# EasyEDA Pro project 同轴电缆.eprj, board 信号调理
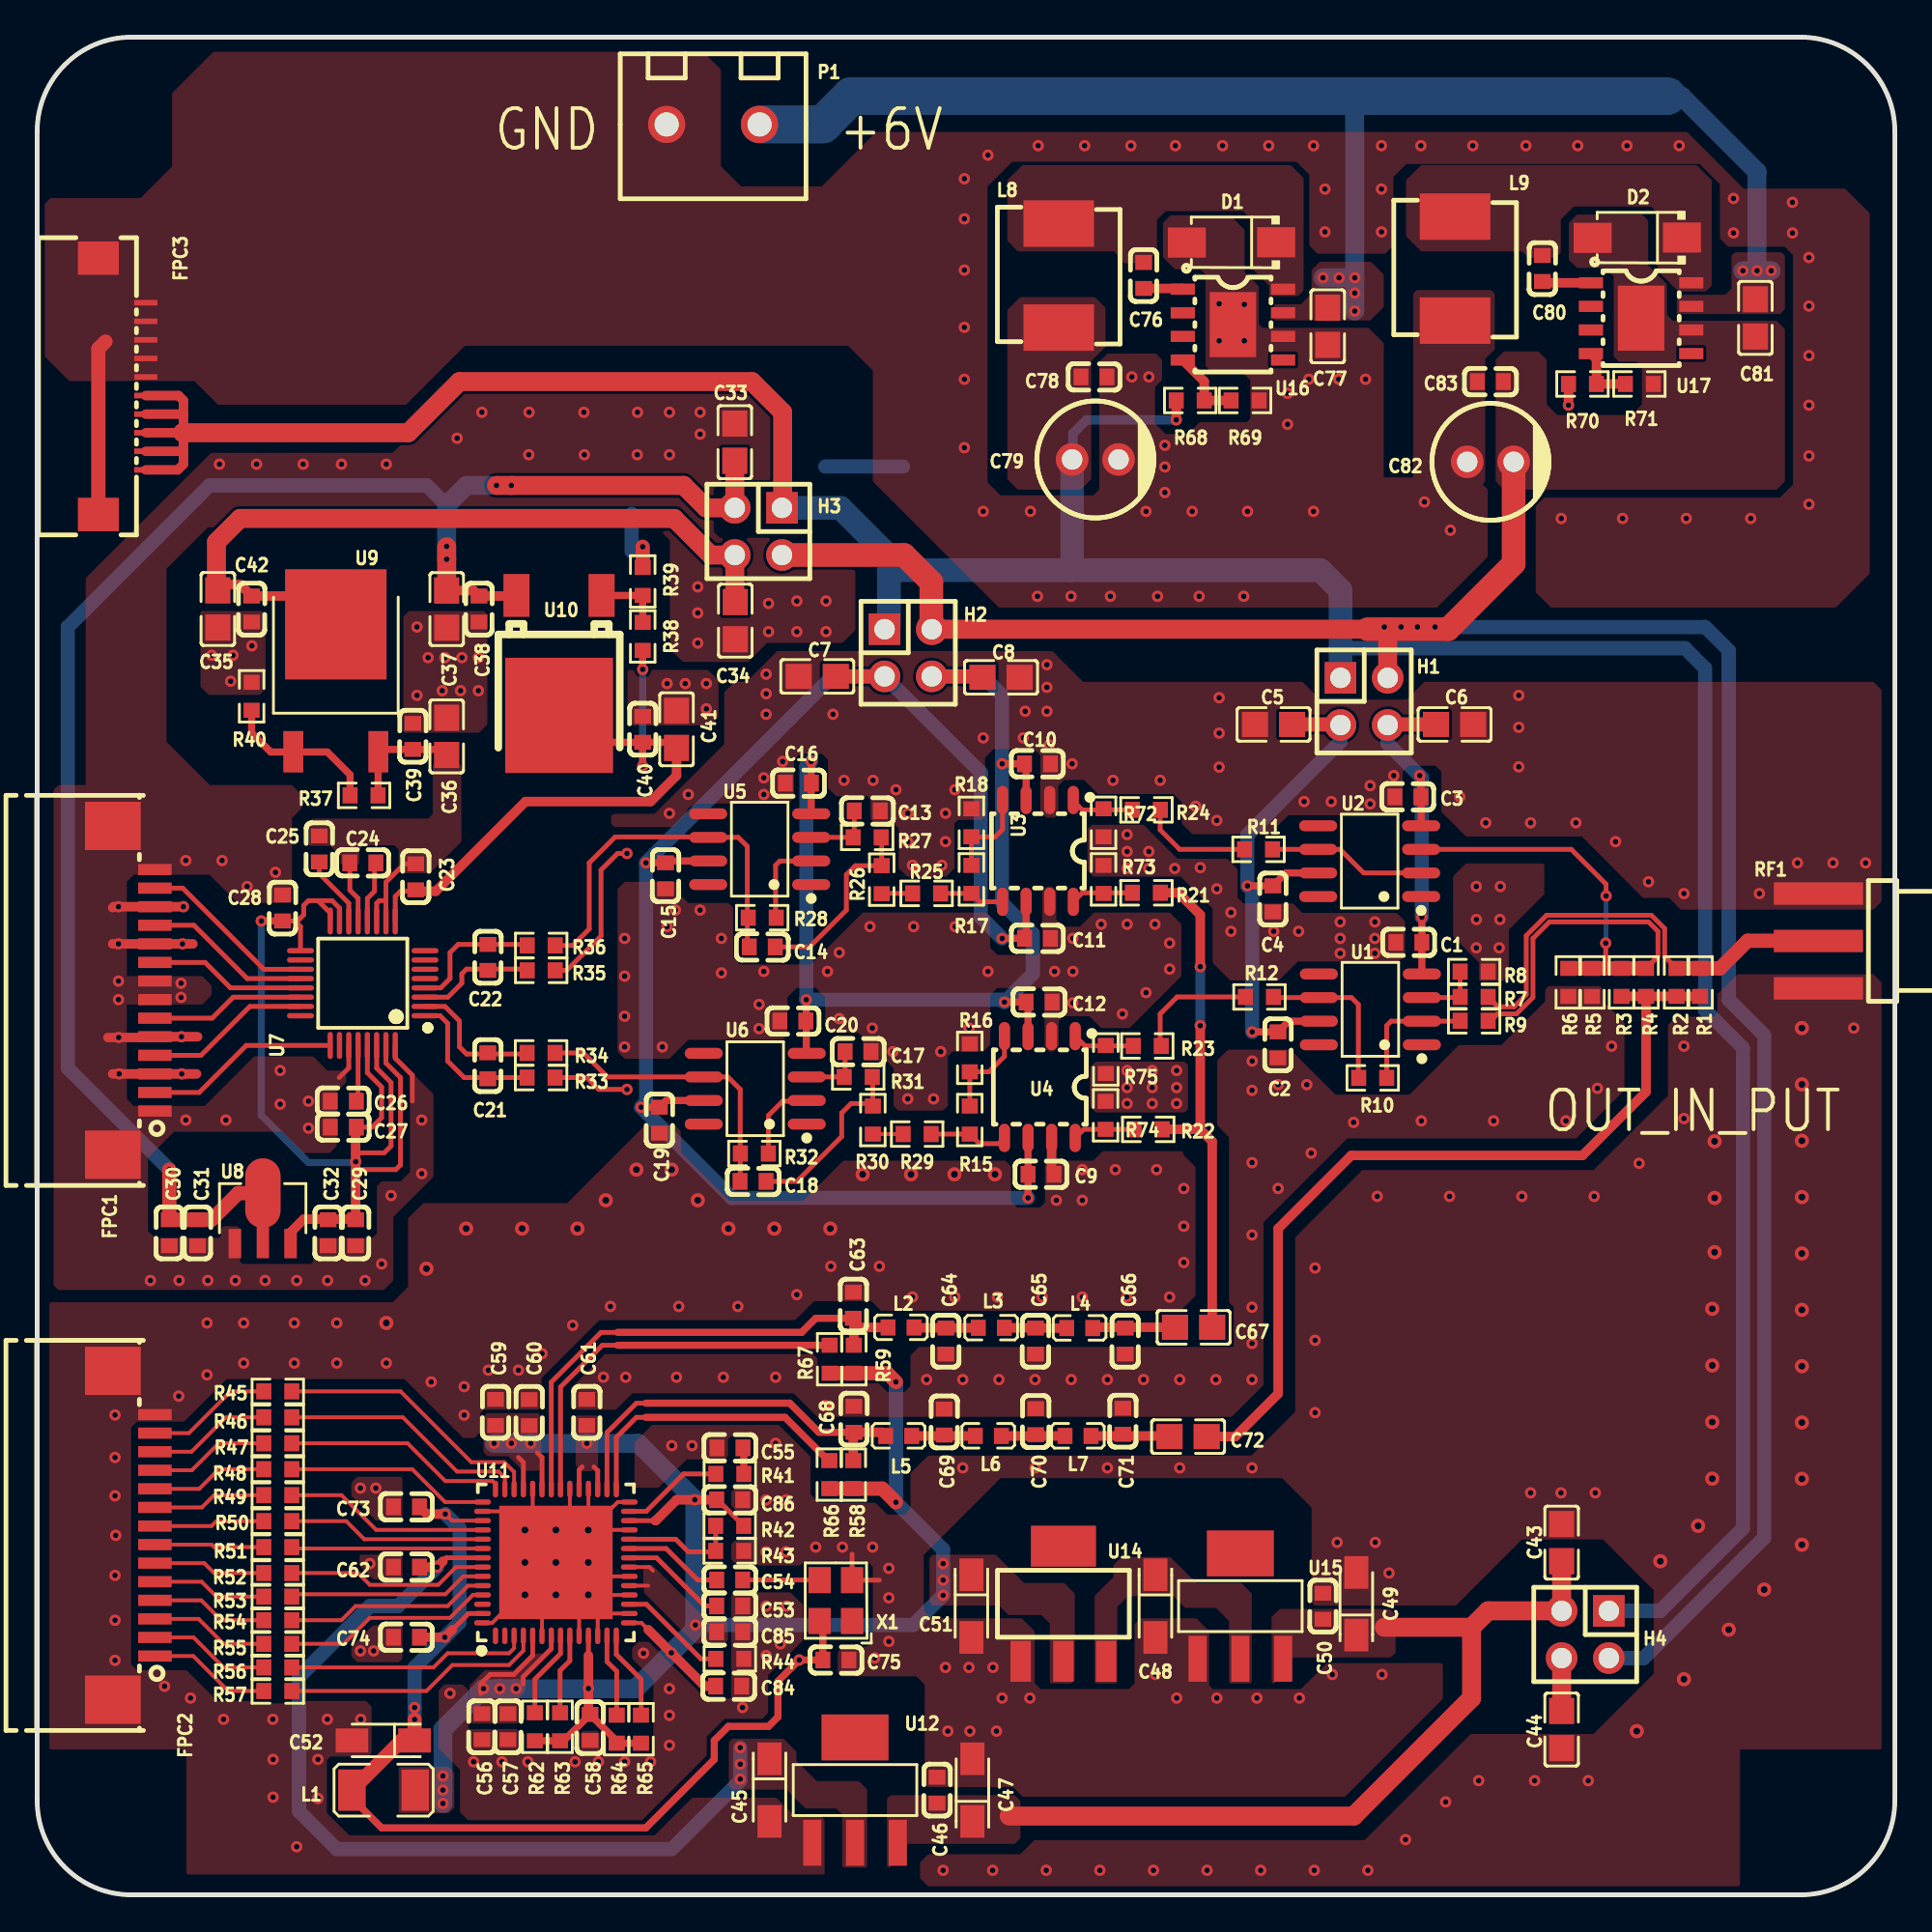
[diagram p5: board, top side]
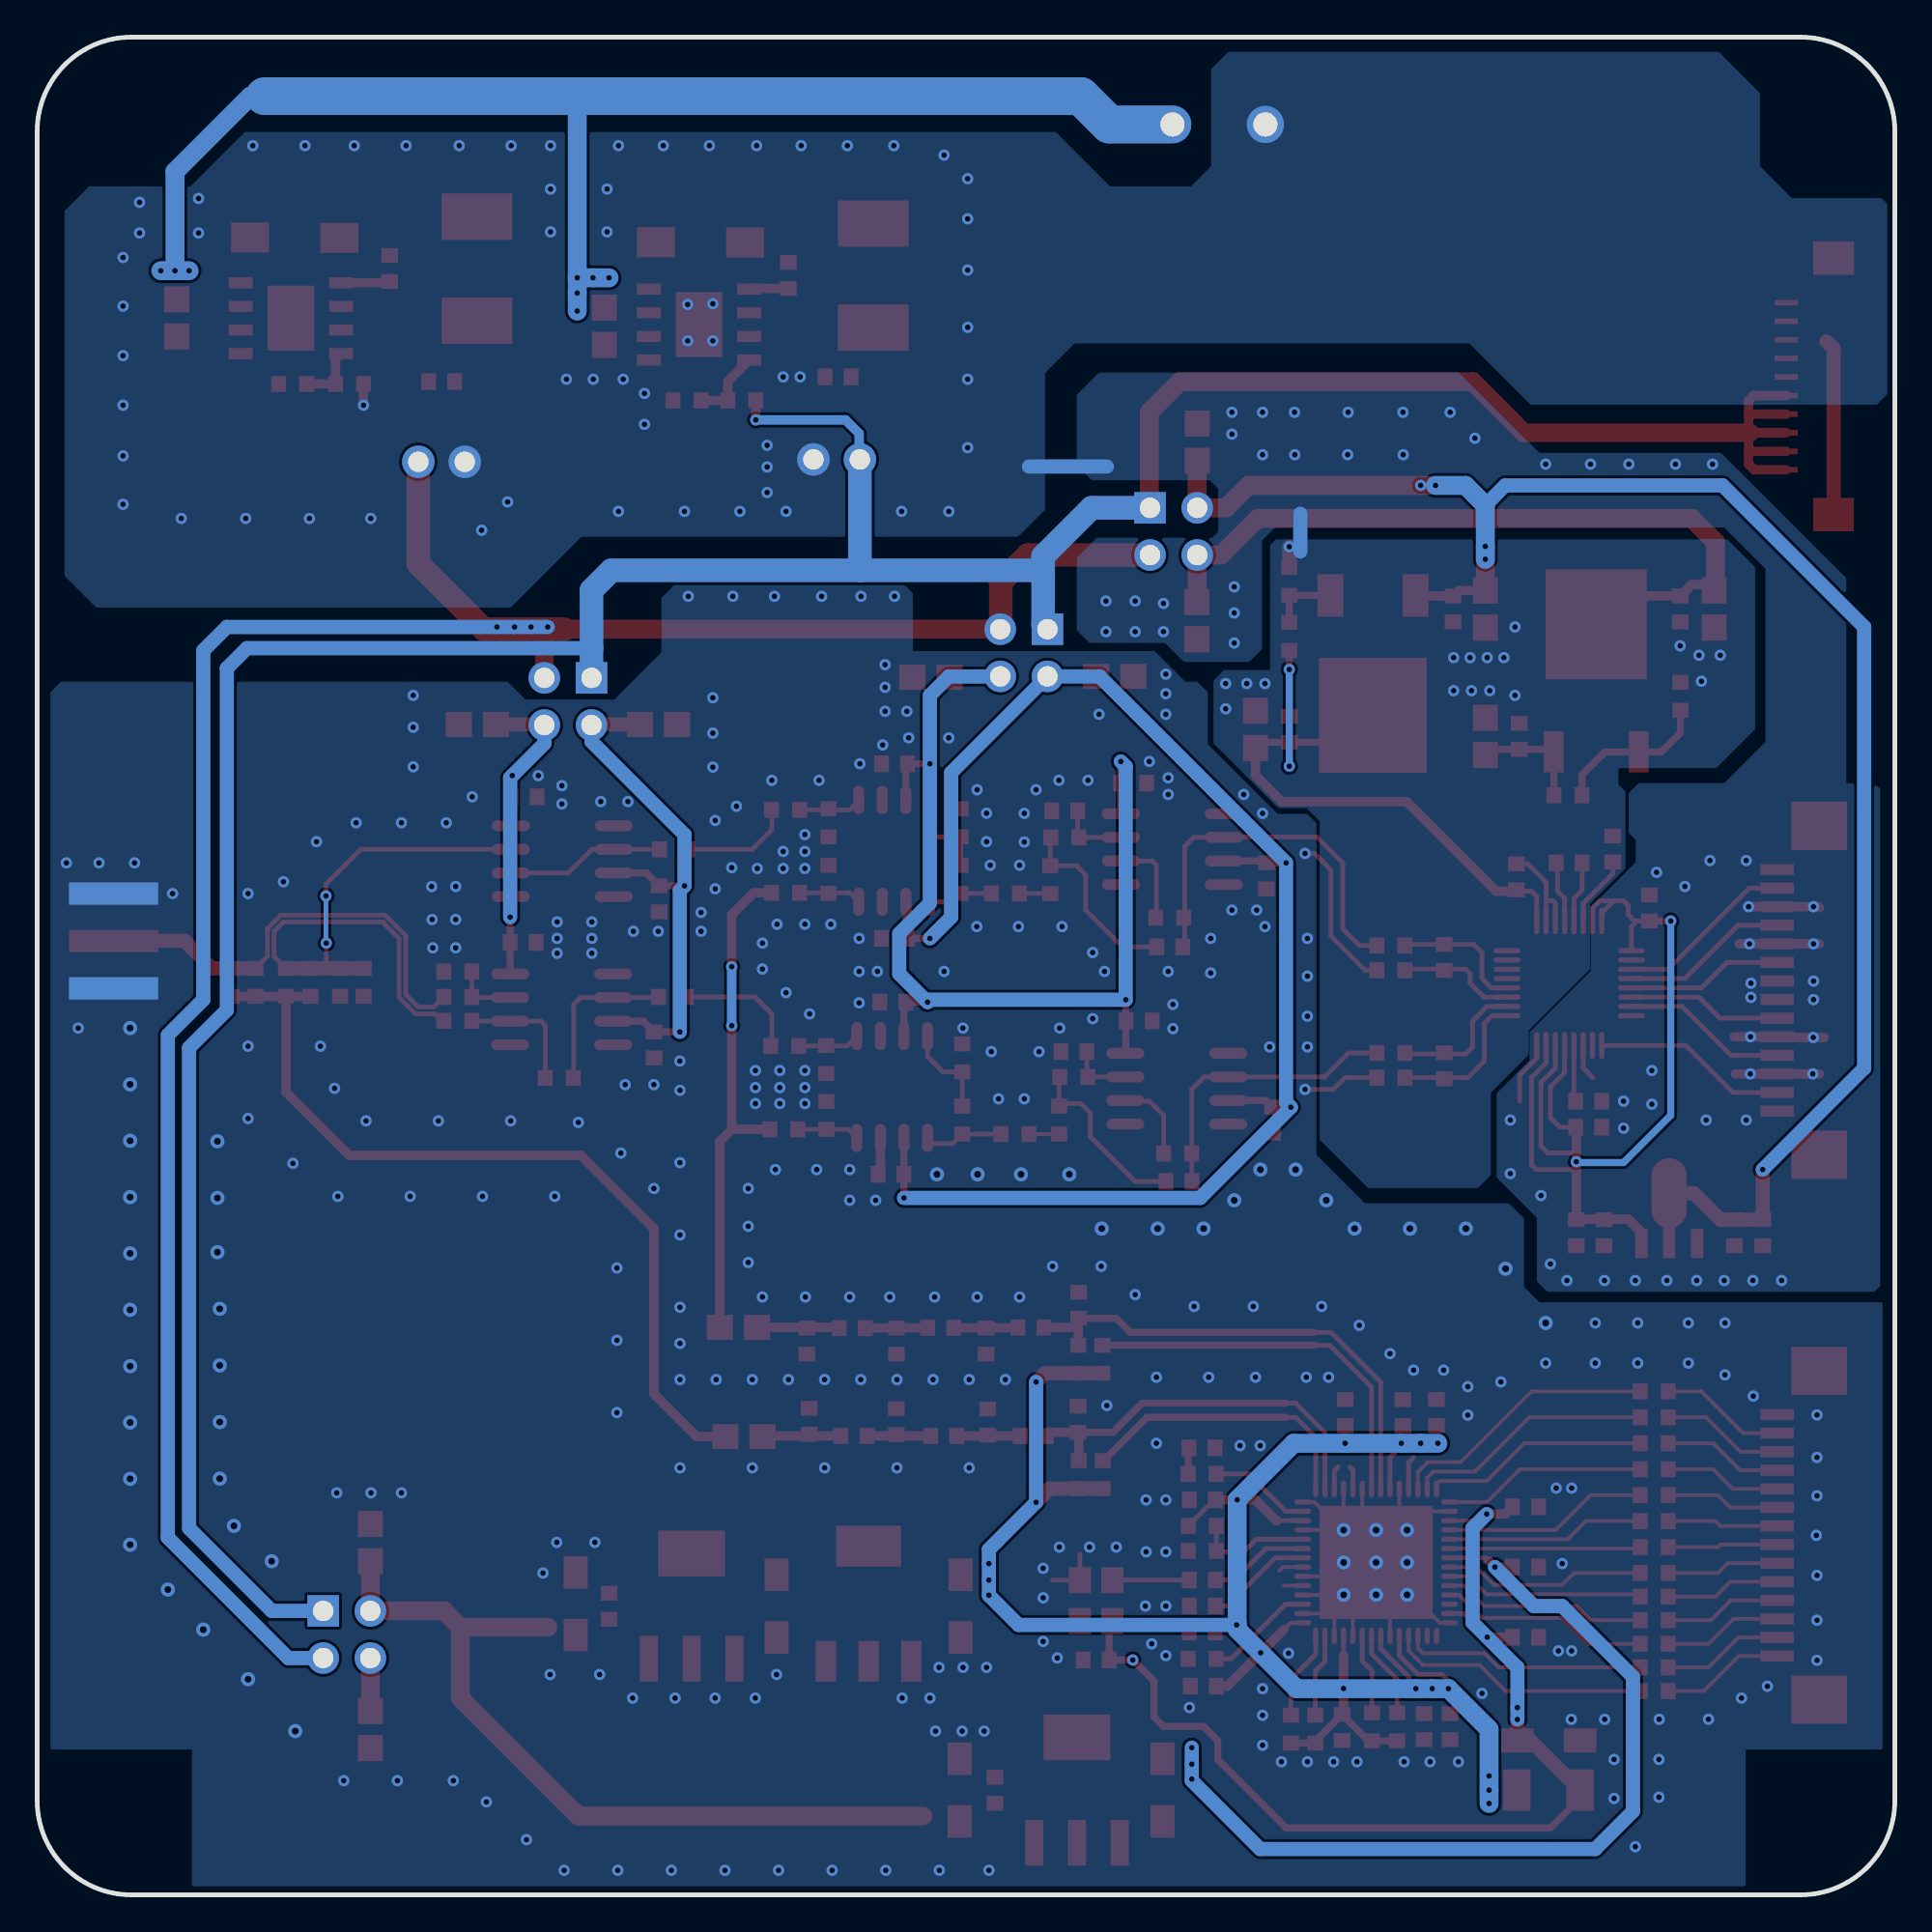
[diagram p6: board, bottom side, seen from below]

Outline 100 x 100 mm; copper layers: Top Layer, Bottom Layer. Coordinates in mm from the lower left corner of the outline.
Outline path: 0,94.92 0,5.08 arc(1.49,1.49) 5.08,0 94.92,0 arc(98.51,1.49) 100,5.08 100,94.92 arc(98.51,98.51) 94.92,100 5.08,100 arc(1.49,98.51) 0,94.92
Stack: Top Layer 0.035mm / Dielectric1 1.51mm FR4 er 4.5 / Bottom Layer 0.035mm

## Design rules (mm)
template: 自定义配置
spacing copperThickness1oz (default): track to track 0.102, other pairs 0.152 to 0.3
spacing copperThickness2oz: track to track 0.203, other pairs 0.152 to 0.3
track width copperThickness1oz (default): min 0.127, default 0.254, max 2.54
track width copperThickness2oz: min 0.203, default 0.254, max 2.54
differential pair differentialPair (default): width min 0.127, default 0.254, max 2.54; gap min 0.152, default 0.152
via viaSize (default): diameter min 0.5, default 0.61, max 10; hole min 0.3, default 0.305, max 6.3

## Placement (name value [footprint] x y rotation side)
C1  100nF  [C0603]  73.84 51.27 0 top
C2  100nF  [C0603]  66.79 45.75 270 top
C3  100nF  [C0603]  73.79 59.11 0 top
C4  100nF  [C0603]  66.52 53.61 90 top
C5  10uF  [C0805]  66.56 63 0 top
C6  10uF  [C0805]  76.3 63 180 top
C7  10uF  [C0805]  41.99 65.59 0 top
C8  10uF  [C0805]  51.89 65.54 180 top
C9  100nF  [C0603]  54.04 38.79 0 top
C10  100nF  [C0603]  53.85 60.88 0 top
C11  100nF  [C0603]  53.85 51.49 0 top
C12  100nF  [C0603]  53.94 48.06 0 top
C13  1nF  [C0603]  44.69 58.35 180 top
C14  2.2nF  [C0603]  39.03 51.03 180 top
C15  100nF  [C0603]  33.82 54.85 270 top
C16  100nF  [C0603]  40.97 59.84 180 top
C17  1nF  [C0603]  44.19 45.39 180 top
C18  2.2nF  [C0603]  38.54 38.41 180 top
C19  100nF  [C0603]  33.5 41.7 270 top
C20  100nF  [C0603]  40.68 47.04 180 top
C21  1nF  [C0603]  24.26 44.63 270 top
C22  1nF  [C0603]  24.26 50.46 270 top
C23  1uF  [C0603]  20.38 54.8 270 top
C24  1uF  [C0603]  17.53 55.55 0 top
C25  1uF  [C0603]  15.19 56.3 270 top
C26  1uF  [C0603]  16.48 42.72 0 top
C27  1uF  [C0603]  16.48 41.33 0 top
C28  1uF  [C0603]  13.21 53.12 90 top
C29  1uF  [C0603]  17.14 35.64 90 top
C30  1uF  [C0603]  7.11 35.64 90 top
C31  100nF  [C0603]  8.64 35.64 90 top
C32  100nF  [C0603]  15.66 35.64 90 top
C33  10uF  [C0805]  37.55 78.2 270 top
C34  10uF  [C0805]  37.58 68.59 90 top
C35  10uF  [C0805]  9.73 69.22 90 top
C36  10uF  [C0805]  22.04 62.36 270 top
C37  10uF  [C0805]  22.04 69.21 90 top
C38  100nF  [C0603]  23.78 69.22 90 top
C39  100nF  [C0603]  20.22 62.36 270 top
C40  100nF  [C0603]  32.59 62.74 270 top
C41  10uF  [C0805]  34.42 62.74 270 top
C42  100nF  [C0603]  11.55 69.22 90 top
C43  10uF  [C0805]  82.06 18.96 270 top
C44  10uF  [C0805]  82.06 8.9 90 top
C45  10uF  [CAP-SMD_L3.2-W1.6-RD-C7171]  39.42 5.64 270 top
C46  10uF  [CAP-SMD_L3.2-W1.6-RD-C7171]  50.34 5.64 90 top
C47  100nF  [C0603]  48.44 5.63 270 top
C48  10uF  [CAP-SMD_L3.2-W1.6-RD-C7171]  60.2 15.54 270 top
C49  10uF  [CAP-SMD_L3.2-W1.6-RD-C7171]  71.01 15.67 90 top
C50  100nF  [C0603]  69.21 15.54 270 top
C51  10uF  [CAP-SMD_L3.2-W1.6-RD-C7171]  50.29 15.54 270 top
C52  10uF  [CAP-SMD_L3.2-W1.6-RD-C7171]  18.63 8.31 180 top
C53  10nF  [C0603]  37.28 15.55 180 top
C54  10nF  [C0603]  37.28 16.95 180 top
C55  680pF  [C0603]  37.3 24.06 0 top
C56  100nF  [C0603]  23.94 9.05 90 top
C57  100nF  [C0603]  25.34 9.05 90 top
C58  100nF  [C0603]  29.76 9.01 90 top
C59  100nF  [C0603]  24.67 25.97 270 top
C60  100nF  [C0603]  26.48 25.96 270 top
C61  100nF  [C0603]  29.59 25.97 270 top
C62  100nF  [C0603]  19.88 17.64 0 top
C63  4.7pF  [C0603]  43.94 31.74 270 top
C64  24pF  [C0603]  48.92 29.81 90 top
C65  33pF  [C0603]  53.74 29.81 90 top
C66  18pF  [C0603]  58.57 29.81 90 top
C67  10uF  [C0805]  62.25 30.55 180 top
C68  4.7pF  [C0603]  43.96 25.6 270 top
C69  24pF  [C0603]  48.83 25.45 270 top
C70  33pF  [C0603]  53.75 25.47 270 top
C71  18pF  [C0603]  58.44 25.49 270 top
C72  10uF  [C0805]  61.95 24.67 180 top
C73  100nF  [C0603]  19.88 20.89 0 top
C74  100nF  [C0603]  19.88 13.87 0 top
C75  10nF  [C0603]  43 12.64 180 top
C76  10nF  [C0603]  59.56 87.17 90 top
C77  10uF  [C0805]  69.47 84.44 90 top
C78  100nF  [C0603]  56.89 81.71 180 top
C79  220uF  [CAP-TH_BD6.3-P2.50-D0.6-FD-1]  56.96 77.27 0 top
C80  10nF  [C0603]  81.03 87.55 90 top
C81  10uF  [C0805]  92.49 84.89 90 top
C82  100nF  [C0603]  78.22 81.46 180 top
C83  220uF  [CAP-TH_BD6.3-P2.50-D0.6-FD-1]  78.23 77.14 0 top
C84  100nF  [C0603]  37.22 11.23 180 top
C85  100nF  [C0603]  37.28 14.16 180 top
C86  100nF  [C0603]  37.28 21.27 180 top
D1  SS54  [SMA_L4.3-W2.6-LS5.0-RD]  64.29 88.95 180 top
D2  SS54  [SMA_L4.3-W2.6-LS5.0-RD]  86.14 89.2 180 top
FPC1  AFA07-S14FCA-00  [FPC-SMD_P1.00-14P_LCS-XJ-H2.5]  5.21 48.69 90 top
FPC2  AFA07-S14FCA-00  [FPC-SMD_P1.00-14P_LCS-XJ-H2.5]  5.21 19.35 90 top
FPC3  AFA01-S10FCA-00  [FPC-SMD_10P-P1.0_FGS-XJ-H2.0]  4.57 81.2 90 top
H1  PZ254V-12-4P  [HDR-TH_4P-P2.54-V-M-R2-C2-S2.54]  71.43 64.24 270 top
H2  PZ254V-12-4P  [HDR-TH_4P-P2.54-V-M-R2-C2-S2.54]  46.89 66.86 270 top
H3  PZ254V-12-4P  [HDR-TH_4P-P2.54-V-M-R2-C2-S2.54]  38.82 73.39 180 top
H4  PZ254V-12-4P  [HDR-TH_4P-P2.54-V-M-R2-C2-S2.54]  83.33 14.02 180 top
L1  10uH  [L1210]  18.65 5.64 180 top
L2  47nH  [L0603]  46.5 30.54 0 top
L3  82nH  [L0603]  51.36 30.52 0 top
L4  68nH  [L0603]  56.12 30.51 0 top
L5  47nH  [L0603]  46.38 24.7 0 top
L6  82nH  [L0603]  51.2 24.7 0 top
L7  68nH  [L0603]  56.03 24.7 0 top
L8  22uH  [IND-SMD_L7.1-W6.6_SLO0618H]  54.99 87.17 270 top
L9  22uH  [IND-SMD_L7.1-W6.6_SLO0618H]  76.33 87.54 270 top
P1  WJ126V-5.0-2P  [CONN-TH_WJ126V-5.0-2P]  36.39 95.3 270 top
R1  100Ω  [R0603]  89.51 49.12 270 top
R2  100Ω  [R0603]  88.25 49.12 270 top
R3  100Ω  [R0603]  85.29 49.12 270 top
R4  100Ω  [R0603]  86.61 49.12 270 top
R5  100Ω  [R0603]  83.69 49.12 90 top
R6  100Ω  [R0603]  82.42 49.12 90 top
R7  10kΩ  [R0603]  77.35 48.33 0 top
R8  10kΩ  [R0603]  77.35 49.7 180 top
R9  10kΩ  [R0603]  77.35 47.05 180 top
R10  10kΩ  [R0603]  71.89 43.98 180 top
R11  49.9Ω  [R0603]  65.75 56.28 0 top
R12  49.9Ω  [R0603]  65.8 48.33 0 top
R15  2kΩ  [R0603]  50.2 41.71 270 top
R16  2kΩ  [R0603]  50.2 45.06 270 top
R17  2kΩ  [R0603]  50.29 54.66 270 top
R18  2kΩ  [R0603]  50.29 57.71 270 top
R21  49.9Ω  [R0603]  59.71 53.94 0 top
R22  49.9Ω  [R0603]  59.81 41.21 0 top
R23  0Ω  [R0603]  59.76 45.69 180 top
R24  0Ω  [R0603]  59.71 58.41 180 top
R25  0Ω  [R0603]  47.88 53.91 180 top
R26  2.7kΩ  [R0603]  45.46 54.65 90 top
R27  4.7kΩ  [R0603]  44.68 56.92 180 top
R28  0Ω  [R0603]  39.03 52.6 180 top
R29  0Ω  [R0603]  47.37 40.95 180 top
R30  2.7kΩ  [R0603]  44.99 41.71 90 top
R31  4.7kΩ  [R0603]  44.2 44.03 180 top
R32  0Ω  [R0603]  38.61 39.91 180 top
R33  10Ω  [R0603]  27.13 43.99 180 top
R34  10Ω  [R0603]  27.13 45.32 180 top
R35  10Ω  [R0603]  27.13 49.77 180 top
R36  10Ω  [R0603]  27.13 51.11 180 top
R37  1kΩ  [R0603]  17.6 59.18 0 top
R38  1kΩ  [R0603]  32.6 67.74 270 top
R39  1kΩ  [R0603]  32.6 70.7 270 top
R40  1kΩ  [R0603]  11.55 64.52 270 top
R41  1kΩ  [R0603]  37.29 22.66 180 top
R42  0Ω  [R0603]  37.28 19.86 0 top
R43  NC  [R0603]  37.28 18.52 180 top
R44  1.8kΩ  [R0603]  37.29 12.7 180 top
R45  100Ω  [R0603]  12.95 27.1 0 top
R46  100Ω  [R0603]  12.95 25.71 0 top
R47  100Ω  [R0603]  12.95 24.31 0 top
R48  100Ω  [R0603]  12.95 22.91 0 top
R49  100Ω  [R0603]  12.95 21.51 0 top
R50  100Ω  [R0603]  12.95 20.12 0 top
R51  100Ω  [R0603]  12.95 18.72 0 top
R52  100Ω  [R0603]  12.95 17.32 0 top
R53  100Ω  [R0603]  12.95 16.05 0 top
R54  100Ω  [R0603]  12.95 14.78 0 top
R55  100Ω  [R0603]  12.95 13.51 0 top
R56  100Ω  [R0603]  12.95 12.24 0 top
R57  100Ω  [R0603]  12.95 10.97 0 top
R58  49.9Ω  [R0603]  43.93 22.62 90 top
R59  49.9Ω  [R0603]  43.96 28.83 90 top
R62  100Ω  [R0603]  26.79 9.05 90 top
R63  100Ω  [R0603]  28.15 9.05 90 top
R64  100Ω  [R0603]  31.2 8.92 90 top
R65  100Ω  [R0603]  32.51 8.92 90 top
R66  100Ω  [R0603]  42.65 22.62 90 top
R67  100Ω  [R0603]  42.66 28.83 90 top
R68  10kΩ  [R0603]  62.07 80.44 180 top
R69  3.24kΩ  [R0603]  65.02 80.44 180 top
R70  10kΩ  [R0603]  83.19 81.33 180 top
R71  3.24kΩ  [R0603]  86.25 81.33 180 top
R72  2kΩ  [R0603]  57.4 57.71 270 top
R73  2kΩ  [R0603]  57.4 54.66 270 top
R74  2kΩ  [R0603]  57.51 41.96 270 top
R75  2kΩ  [R0603]  57.53 44.97 270 top
RF1  BWSMA-KE-P001  [SMA-SMD_BWSMA-KE-P001]  95.88 51.35 0 top
U1  THS4011IDG4  [SOIC-8_L4.9-W3.9-P1.27-LS6.0-BL]  71.77 47.66 90 top
U2  THS4011IDG4  [SOIC-8_L4.9-W3.9-P1.27-LS6.0-BL]  71.73 55.64 90 top
U3  AD835ARZ  [SOIC-8_L4.9-W3.9-P1.27-LS6.0-TL]  53.87 56.2 270 top
U4  AD835ARZ  [SOIC-8_L4.9-W3.9-P1.27-LS6.0-TL]  53.97 43.48 270 top
U5  OPA227UA  [SOIC-8_L4.9-W3.9-P1.27-LS6.0-BL]  38.9 56.29 90 top
U6  OPA227UA  [SOIC-8_L4.9-W3.9-P1.27-LS6.0-BL]  38.65 43.39 90 top
U7  ADS131A04IPBS  [TQFP-32_L5.0-W5.0-P0.50-LS7.0-BL]  17.53 49.07 90 top
U8  HT7533-1  [SOT-89_L4.5-W2.5-P1.50-LS4.2-BR]  12.14 36.42 270 top
U9  LM337KVURG3  [DPAK-3_L6.6-W6.1-P2.28-LS9.9-BR]  16.08 64.96 270 top
U10  LM317MKVURG3  [TO-252-3_L6.5-W6.1-P4.58-TL]  28.09 66.72 270 top
U11  AD9959BCPZ-REEL7  [LFCSP-56_L8.0-W8.0-P0.50-BL-EP]  27.92 17.89 0 top
U12  AMS1117-3.3  [SOT-223-4_L6.5-W3.5-P2.30-LS7.0-BR]  44.03 5.64 270 top
U14  AMS1117-1.8  [SOT-223_L6.7-W3.5-P2.30-BR]  55.24 15.67 270 top
U15  AMS1117-3.3  [SOT-223-4_L6.5-W3.5-P2.30-LS7.0-BR]  64.77 15.54 270 top
U16  TPS5430DDAR  [ESOP-8_L4.9-W3.9-P1.27-LS6.0-TL-EP]  64.37 84.53 0 top
U17  TPS5430DDAR  [ESOP-8_L4.9-W3.9-P1.27-LS6.0-TL-EP]  86.34 84.87 0 top
X1  25MHz  [OSC-SMD_4P-L3.2-W2.5-BL]  43 15.84 90 top

## Footprints (pads in the part's own frame, mm; a bottom-side part is the same pattern mirrored in y, then rotated)
C0603
  rect 0.8x0.9 smd: 1(-0.7,0) 2(0.7,0)
C0805
  rect 1.41x1.35 smd: 1(-1,0) 2(1,0)
CAP-SMD_L3.2-W1.6-RD-C7171
  rect 1.758x1.296 smd: 1(-1.687,0) 2(1.687,0)
CAP-TH_BD6.3-P2.50-D0.6-FD-1
  round 1.75 hole 1.1: 1(-1.25,0) 2(1.25,0)
CONN-TH_WJ126V-5.0-2P
  round 2 hole 1.3: 1(0,2.501) 2(0,-2.501)
DPAK-3_L6.6-W6.1-P2.28-LS9.9-BR
  rect 2.223x1.071 smd: 1(3.428,-2.29) 3(3.428,2.29)
  rect 5.925x5.46 smd: 2(-3.428,0)
ESOP-8_L4.9-W3.9-P1.27-LS6.0-TL-EP
  rect 1.3x0.6 smd: 1(-2.7,1.905) 2(-2.7,0.635) 3(-2.7,-0.635) 4(-2.7,-1.905) 5(2.7,-1.905) 6(2.7,-0.635) 7(2.7,0.635) 8(2.7,1.905)
  rect 2.5x3.5 smd: 9(0,0)
FPC-SMD_10P-P1.0_FGS-XJ-H2.0
  rect 0.3x1.25 smd: 1(-4.497,-1.276) 2(-3.498,-1.276) 3(-2.498,-1.276) 4(-1.497,-1.276) 5(-0.497,-1.276) 6(0.502,-1.276) 7(1.502,-1.276) 8(2.503,-1.276) 9(3.502,-1.274) 10(4.503,-1.274)
  rect 1.8x2.2 smd: 11(-6.9,1.276) 12(6.9,1.276)
FPC-SMD_P1.00-14P_LCS-XJ-H2.5
  rect 0.6x1.8 smd: 1(-6.5,-1.133) 2(-5.5,-1.131) 3(-4.5,-1.131) 4(-3.5,-1.131) 5(-2.5,-1.131) 6(-1.5,-1.131) 7(-0.5,-1.131) 8(0.499,-1.131) 9(1.5,-1.131) 10(2.499,-1.131) 11(3.499,-1.131) 12(4.5,-1.131) 13(5.5,-1.131) 14(6.5,-1.131)
  rect 2.6x3 smd: 15(-8.85,1.133) 16(8.85,1.133)
HDR-TH_4P-P2.54-V-M-R2-C2-S2.54
  rect 1.7x1.7 hole 1.1: 1(-1.27,-1.27)
  round 1.7 hole 1.1: 2(-1.27,1.27) 3(1.27,-1.27) 4(1.27,1.27)
IND-SMD_L7.1-W6.6_SLO0618H
  rect 2.5x3.8 smd: 1(-2.8,0) 2(2.8,0)
L0603
  rect 0.8x0.864 smd: 1(-0.7,0) 2(0.7,0)
L1210
  rect 1.474x2.22 smd: 1(-1.703,0) 2(1.703,0)
LFCSP-56_L8.0-W8.0-P0.50-BL-EP
  oval 0.28x0.9 smd: 1(-3.251,-3.95) 2(-2.751,-3.95) 3(-2.251,-3.95) 4(-1.75,-3.95) 5(-1.25,-3.95) 6(-0.749,-3.95) 7(-0.249,-3.95) 8(0.249,-3.95) 9(0.75,-3.95) 10(1.25,-3.95) 11(1.75,-3.95) 12(2.251,-3.95) 13(2.751,-3.95) 14(3.252,-3.95) 29(3.252,3.95) 30(2.751,3.95) 31(2.251,3.95) 32(1.75,3.95) 33(1.25,3.95) 34(0.75,3.95) 35(0.249,3.95) 36(-0.249,3.95) 37(-0.749,3.95) 38(-1.25,3.95) 39(-1.75,3.95) 40(-2.251,3.95) 41(-2.751,3.95) 42(-3.251,3.95)
  oval 0.9x0.28 smd: 15(3.95,-3.252) 16(3.95,-2.751) 17(3.95,-2.251) 18(3.95,-1.75) 19(3.95,-1.25) 20(3.95,-0.75) 21(3.95,-0.249) 22(3.95,0.249) 23(3.95,0.749) 24(3.95,1.25) 25(3.95,1.75) 26(3.95,2.251) 27(3.95,2.751) 28(3.95,3.251) 43(-3.95,3.251) 44(-3.95,2.751) 45(-3.95,2.251) 46(-3.95,1.75) 47(-3.95,1.25) 48(-3.95,0.749) 49(-3.95,0.249) 50(-3.95,-0.249) 51(-3.95,-0.75) 52(-3.95,-1.25) 53(-3.95,-1.75) 54(-3.95,-2.251) 55(-3.95,-2.751) 56(-3.95,-3.252)
  rect 6.1x6.1 smd: 57(0,0)
OSC-SMD_4P-L3.2-W2.5-BL
  rect 1.4x1.2 smd: 1(-1.1,-0.875) 2(1.1,-0.875) 3(1.1,0.875) 4(-1.1,0.875)
R0603
  rect 0.806x0.864 smd: 1(-0.753,0) 2(0.753,0)
SMA-SMD_BWSMA-KE-P001
  rect 4.8x1.2 smd: 1(0,-2.55) 2(0,2.55) 5(0,0)
  rect 4.8x1.2 smd far side: 3(0,2.55) 4(0,-2.55)
SMA_L4.3-W2.6-LS5.0-RD
  rect 2.046x1.62 smd: 1(-2.404,-0.009) 2(2.404,0.009)
SOIC-8_L4.9-W3.9-P1.27-LS6.0-BL
  oval 0.588x2.045 smd: 1(-1.905,-2.772) 2(-0.635,-2.772) 3(0.635,-2.772) 4(1.905,-2.772) 5(1.905,2.772) 6(0.635,2.772) 7(-0.635,2.772) 8(-1.905,2.772)
SOIC-8_L4.9-W3.9-P1.27-LS6.0-TL
  oval 1.52x0.6 smd: 1(-2.74,1.905) 2(-2.74,0.635) 3(-2.74,-0.635) 4(-2.74,-1.905) 5(2.74,-1.905) 6(2.74,-0.635) 7(2.74,0.635) 8(2.74,1.905)
SOT-89_L4.5-W2.5-P1.50-LS4.2-BR
  rect 1.575x0.672 smd: 1(1.356,-1.5) 3(1.356,1.5)
  custom 5.377x1.9 smd: 2(-1.356,0.009)
SOT-223-4_L6.5-W3.5-P2.30-LS7.0-BR
  rect 2.47x0.98 smd: 1(2.835,-2.3) 2(2.835,0) 3(2.835,2.3)
  rect 2.47x3.6 smd: 4(-2.835,0)
SOT-223_L6.7-W3.5-P2.30-BR
  rect 2.2x1.1 smd: 1(3.099,-2.3) 2(3.099,0) 3(3.099,2.3)
  rect 2.2x3.5 smd: 4(-3.099,0)
TO-252-3_L6.5-W6.1-P4.58-TL
  rect 2.3x1.4 smd: 1(-3.228,2.29) 3(-3.228,-2.29)
  rect 6.2x5.8 smd: 2(3.228,0.004)
TQFP-32_L5.0-W5.0-P0.50-LS7.0-BL
  oval 0.28x1.45 smd: 1(-1.75,-3.35) 2(-1.25,-3.35) 3(-0.75,-3.35) 4(-0.25,-3.35) 5(0.25,-3.35) 6(0.75,-3.35) 7(1.25,-3.35) 8(1.75,-3.35) 17(1.75,3.35) 18(1.25,3.35) 19(0.75,3.35) 20(0.25,3.35) 21(-0.25,3.35) 22(-0.75,3.35) 23(-1.25,3.35) 24(-1.75,3.35)
  oval 1.45x0.28 smd: 9(3.35,-1.75) 10(3.35,-1.25) 11(3.35,-0.75) 12(3.35,-0.25) 13(3.35,0.25) 14(3.35,0.75) 15(3.35,1.25) 16(3.35,1.75) 25(-3.35,1.75) 26(-3.35,1.25) 27(-3.35,0.75) 28(-3.35,0.25) 29(-3.35,-0.25) 30(-3.35,-0.75) 31(-3.35,-1.25) 32(-3.35,-1.75)

## Nets
As in the schematic.

Pads without a net: U1 1 5 8; U2 1 5 8; U5 1 5 8; U6 1 5 8; U7 5 6 7 8 18 24 26; U11 1 2 54; U12 4; U14 4; U15 4; U16 2 3 5; U17 2 3 5; X1 1

## Via types
v1: diameter 0.61, hole 0.305, Top Layer to Bottom Layer, 512 vias
v2: diameter 0.762, hole 0.381, Top Layer to Bottom Layer, 48 vias

## Routing (per net, layer and track width the routed paths; a pad name or vN(x,y) marks a point on that pad's centre or on a via; arc(x,y) is an arc through that point)
+2.5V: length 35.3
  Top Layer w0.254: C23.2 20.3,54.03 19.56,54.03 19.28,53.74 19.28,52.42
  Top Layer w0.381: C40.2 v1(32.59,60.76) ; C40.2 29.55,62.04 28.1,63.49 ; C40.2 34.12,62.04 C41.2 ; R38.2 v1(32.6,65.96)
  Top Layer w0.508: 20.3,54.03 21.46,54.03 26.29,58.85 33.02,58.85 34.42,60.25 C41.2
  Bottom Layer w0.381: v1(32.59,60.76) 32.6,60.76 v1(32.6,65.96)
+3.3V: length 57.8
  Top Layer w0.254: 17.14,39.94 18.68,39.94 19.05,40.31 19.05,43.73 18.28,44.5 U7.30 ; 16.28,52.42 16.28,53.12 15.88,53.52 15.11,53.52 ; 15.11,53.52 15.78,52.86 15.78,52.42 ; 15.11,53.52 14.61,53.52 14.35,53.26 14.35,52.76 14.02,52.42 13.87,52.42 ; 13.87,52.42 C28.1 ; 13.87,52.42 14.18,52.12 U7.17 ; U7.31 18.78,44.78 19.56,43.99 19.56,39.29 19.3,39.04 17.19,39.04 17.14,39 ; U7.29 17.78,44.25 18.54,43.48 18.54,41.83 18.03,41.33 C27.2
  Top Layer w0.381: C28.1 v1(12.06,52.42)
  Top Layer w0.508: U8.3 13.64,35.66 14.35,36.37 17.11,36.37 17.14,36.34 v1(17.14,39.47) 17.14,41.29 C27.2
  Bottom Layer w0.381: v1(12.06,52.42) 12.06,41.96 14.61,39.42 17.1,39.42 v1(17.14,39.47)
+5V: length 184
  Top Layer w0.508: 7.87,77.76 7.82,77.71 FPC3.2 ; 7.87,77.76 7.87,78.71 ; 7.87,77.76 7.87,77.01 7.57,76.71 FPC3.1 ; FPC3.4 7.84,79.71 7.87,79.67 ; 7.87,79.67 7.87,80.44 7.61,80.71 FPC3.5 ; 7.87,79.67 7.87,78.75 ; FPC3.3 7.83,78.71 ; v1(61.32,79.39) R68.2
  Top Layer w1.016: H3.1 40.13,74.7 40.13,79.81 38.48,81.46 22.73,81.46 19.98,78.71 7.83,78.71
  Bottom Layer w0.508: C79.1 55.75,77.31 55.75,78.66 56.48,79.39 v1(61.32,79.39)
  Bottom Layer w0.762: H4.1 87.37,15.29 91.82,19.74 91.82,45.59 89.79,47.63 89.79,66.03 88.71,67.11 70.16,67.11
  Bottom Layer w1.27: 55.66,71.3 55.71,71.35 C79.1 ; 55.66,71.3 45.96,71.3 45.85,71.18 ; 55.66,71.3 69.09,71.3 70.16,70.23 H1.1 ; H2.1 45.85,68.36 45.85,71.18 ; H3.1 43.24,74.66 45.85,72.06 45.85,71.18
+5V_A: length 29.2
  Top Layer w0.381: U2.7 67.22,55.01 C4.2 v1(65.15,54.31) ; v1(65.41,46.45) C2.1 67.37,47.03 U1.7
  Top Layer w0.762: C5.2 70.13,63 H1.3
  Bottom Layer w0.762: H1.3 70.16,62.08 65.15,57.07 v1(65.15,54.31) 65.41,54.06 v1(65.41,46.45)
+5V_B: length 85.8
  Top Layer w0.381: v1(53.34,37.52) C9.1 U4.6 ; 53.24,53.46 53.24,51.58 C11.1 v1(51.94,51.49) ; U5.7 33.92,55.65 C15.1 v1(32.77,55.55) ; v1(32.51,42.4) C19.1 33.85,42.76 U6.7
  Top Layer w0.762: C7.2 H2.3
  Bottom Layer w0.762: v1(53.34,37.52) 37.4,37.52 v1(32.51,42.4) 32.77,42.66 v1(32.77,55.55) 42.81,65.59 H2.3 50.8,60.41 50.8,52.63 v1(51.94,51.49)
+5V_C: length 91.9
  Top Layer w0.508: 25.8,69.95 25.77,69.92 C38.2 23.49,70.21 C37.2
  Top Layer w0.762: v1(7.11,39.04) 7.11,36.34 9.39,36.34 10.82,37.77 U8.2
  Top Layer w1.016: 22.04,72.57 v1(22.04,71.89) C37.2 ; v1(24.73,75.87) v1(25.53,75.87) 34.8,75.87 36,74.66 H3.3 C33.2
  Bottom Layer w0.762: 22.04,74.8 20.97,75.87 9.27,75.87 1.65,68.25 1.65,44.5 v1(7.11,39.04)
  Bottom Layer w1.016: v1(24.73,75.87) 23.11,75.87 22.04,74.8 v1(22.04,72.59) v1(22.04,71.89)
+5V_D: length 43.9
  Top Layer w1.016: C43.2 H4.3 82.06,15.29 78.1,15.29 77.22,14.4 ; 72.52,14.4 77.22,14.4 ; 77.22,14.4 77.22,10.59 70.87,4.24 52.32,4.24
+6V: length 75.8
  Bottom Layer w1.016: v1(70.93,87.05) v1(70.08,87.05) v1(69.22,87.05) ; v1(70.93,87.05) 70.93,96.26 70.74,96.44 ; v1(70.93,87.05) v1(70.93,86.23) v1(70.93,85.26) ; v1(92.58,87.43) v1(93.34,87.43) ; v1(92.58,87.43) v1(91.82,87.43) ; v1(92.58,87.43) 92.58,92.76 88.52,96.83 87.76,96.83
  Bottom Layer w2.032: 87.76,96.83 43.81,96.83 42.29,95.3 P1.1
+A1.8V: length 114.6
  Top Layer w0.203: 33.15,17.45 32.95,17.64 U11.21 ; U11.19 32.89,16.64 ; 32.89,14.28 32.53,14.64 U11.15
  Top Layer w0.254: U11.7 27.68,13.25 26.16,11.74 26.16,11.35 ; C86.2 36.63,21.27 R42.2 ; 23.88,10.85 23.88,11.35 24.38,11.86 25.65,11.86 26.67,12.88 U11.5 ; 26.92,23.8 27.18,23.55 U11.37 ; U11.11 29.67,12.88 ; 29.97,23.04 30.18,22.84 30.18,21.84 ; 29.34,23.04 29.17,22.88 U11.33 ; U11.26 33.27,20.14 ; 25.91,23.55 26.17,23.28 U11.39
  Top Layer w0.381: R62.1 R63.1 28.34,8.29 C58.2 31.2,8.28 31.2,8.17 32.51,8.17
  Top Layer w0.508: 29.67,12.88 v1(29.67,11.11) 29.67,9.8 C58.2 ; 32.89,14.28 v1(34.14,13.03) 35.93,11.23 C84.2 ; C86.2 v1(35.4,21.27) 34.42,21.27 33.3,20.14 33.27,20.14
  Top Layer w0.762: R67.1 R59.1 45.76,28.08 v1(46.23,27.61) ; R66.1 R58.1 45.49,21.87 v1(46.23,21.13)
  Bottom Layer w0.762: v1(46.23,27.61) v1(46.23,21.13) 48.77,18.59 v1(48.77,17.83) v1(48.77,16.94) v1(48.77,16.13) 47.17,14.53 v1(35.43,14.53)
  Bottom Layer w1.016: 35.4,14.56 35.4,14.29 v1(34.14,13.03) 32.21,11.1 v1(25.78,11.1) v1(24.9,11.1) v1(24.03,11.1) 21.84,8.91 v1(21.84,6.4) v1(21.84,5.64) v1(21.84,4.92) ; 35.4,14.56 v1(35.4,21.27) 32.36,24.31 v1(29.59,24.31) v1(26.57,24.31) v1(25.53,24.31) v1(24.6,24.31) ; 35.4,14.56 v1(35.43,14.53)
+D1.8V: length 59.7
  Top Layer w0.203: U11.45 22.33,20.14 v1(21.97,20.5)
  Top Layer w0.254: 22.35,14.28 23.22,15.14 U11.55
  Top Layer w0.381: X1.4 42.29,14.57 C75.2 v1(41.02,12.64) 39.88,11.5 39.88,9.58 39.37,9.07 37.21,9.07 36.45,8.31 36.45,7.29 32.77,3.61 18.54,3.61 16.95,5.2 L1.2
  Top Layer w0.508: C73.2 20.97,20.5 v1(21.97,20.5) ; 22.35,14.28 v1(21.94,13.87) C74.2
  Top Layer w0.762: L1.2 19.62,8.31 C52.1 v1(20.32,9.44)
  Bottom Layer w0.762: v1(20.32,9.44) v1(20.32,10.08) 20.32,12.24 v1(21.94,13.87) 22.73,14.66 22.73,19.74 v1(21.97,20.5)
+D3.3V: length 48.6
  Top Layer w0.254: U11.49 22.03,18.14 21.84,17.96
  Top Layer w0.508: 21.84,17.96 v1(21.53,17.64) C62.2
  Bottom Layer w0.762: v1(21.53,17.64) 19.43,15.54 17.91,15.54 14.1,11.74 14.1,4.5 16.13,2.46 34.16,2.46 37.85,6.15 v1(37.85,7.04) v1(37.85,7.93)
  vias: v1(37.85,6.23)
-2.5V: length 15.2
  Top Layer w0.254: 17.28,52.42 17.28,53.64 16.83,54.08 C24.1 ; 18.78,52.42 18.78,53.56 ; 18.78,53.56 18.73,53.52 18.42,53.52 18.28,53.38 18.28,52.42 ; 18.78,53.56 18.78,54.51 19.76,55.5 C23.1
  Top Layer w0.381: 18.35,59.18 18.35,61.52 U9.3 18.49,61.66 C39.2 21.74,61.66 C36.2
-5V: length 130.7
  Top Layer w1.016: H2.2 71.62,68.13 ; 72.7,68.13 H1.2
  Top Layer w1.27: 71.62,68.13 75.95,68.13 79.48,71.66 C83.2 ; H3.2 46.67,72.12 48.13,70.66 48.13,68.15 H2.2
  Bottom Layer w0.762: H4.2 86.48,12.75 92.96,19.23 92.96,46.28 91.06,48.18 91.06,66.98 89.79,68.25 v1(75.25,68.25) v1(74.3,68.25) v1(73.42,68.25) v1(72.52,68.25)
-5V_A: length 19.6
  Top Layer w0.381: U1.4 C1.2 v1(74.54,52.63) ; 74.5,57.55 74.5,60.33
  Top Layer w0.762: H1.4 72.73,63 C6.2
  Bottom Layer w0.762: H1.4 72.7,61.97 v1(74.42,60.25) 74.54,60.13 v1(74.54,52.63)
-5V_B: length 60.4
  Top Layer w0.381: v1(52.07,48.06) 53.24,48.06 53.34,47.95 U4.3 ; U5.4 v1(41.67,61.01) ; v1(51.94,60.88) C10.1 53.24,60.79 53.24,58.94 ; U6.4 41.4,45.32 v1(41.4,48.18)
  Top Layer w0.762: H2.4 50.84,65.59 C8.2
  Bottom Layer w0.762: H2.4 48.16,65.58 50.93,65.58 51.94,64.57 v1(51.94,60.88) 51.94,53.39 53.59,51.74 53.59,49.58 v1(52.07,48.06) 51.94,48.18 v1(41.4,48.18) 41.4,60.75 v1(41.67,61.01)
-5V_C: length 41.6
  Top Layer w0.508: U9.2 14.55,69.92 C42.2 10.93,70.54 9.4,70.54
  Top Layer w1.016: 9.65,70.54 9.65,72.82 10.92,74.09 34.29,74.09 36.26,72.12 H3.4 37.55,69.62 C34.2
-5V_D: length 2.8
  Top Layer w1.016: C44.2 H4.4
GND: length 105.9
  Top Layer w0.203: v2(27.92,17.89) 28,17.89 29.75,19.64 ; v2(27.92,17.89) 28.67,18.64 ; v2(27.92,17.89) 26.67,19.14 ; v2(27.92,17.89) 27.18,17.14 U11.6 ; v2(27.92,17.89) 28.67,17.14 ; v2(27.92,17.89) 27.75,17.89 24.5,14.64 U11.56 ; U11.38 26.67,19.14 ; 26.67,19.14 25.17,20.64 U11.44 ; 28.67,18.64 29.67,19.64 U11.32 ; 28.67,18.64 U11.34 ; 29.75,19.64 31.25,21.14 U11.28 ; 29.75,19.64 U11.25 ; 30.18,15.64 30.68,15.14 U11.16 ; 30.18,15.64 29.67,16.14 ; 30.18,15.64 30.18,13.94 ; 29.67,16.14 U11.18 ; 29.67,16.14 29.17,16.64 ; U11.10 29.17,16.64 ; 29.17,16.64 28.67,17.14 ; 28.67,17.14 U11.20
  Top Layer w0.254: 45.34,16.94 X1.2 43.87,18.34 ; v1(31.75,43.36) 30.23,43.36 29.59,43.99 R33.1 ; 20.19,42.72 20.19,44.12 19.28,45.04 U7.32 ; R35.1 28.51,49.77 30.35,51.61 30.35,55.17 31.24,56.06 v1(31.75,56.06) ; 16.26,43.99 16.78,44.51 U7.27
  Top Layer w0.508: 8.38,51.19 v1(7.83,51.19) FPC1.10 v1(4.38,51.19) 4.06,51.19 ; 3.81,46.15 v1(4.39,46.15) 6.3,46.15 FPC1.5 v1(7.77,46.19) 8.64,46.19 ; 4.06,53.14 4.12,53.19 FPC1.12 v1(7.87,53.19) ; C9.2 54.61,38.92 U4.7 ; 8.58,44.19 v1(7.78,44.19) FPC1.3 v1(4.42,44.19) 4.06,44.19 ; R70.2 v1(82.43,80.19)
  Top Layer w0.762: R39.1 v1(32.6,72.57) ; 3.68,83.62 3.3,83.23 FPC3.11
  Bottom Layer w0.762: 42.42,76.89 46.61,76.89 ; 32,72.31 32,74.35
  vias: v1(4.19,25.83) v1(4.19,23.55) v1(4.19,21.48) v1(4.23,19.35) v1(4.19,17.2) v1(4.19,14.78) v1(4.19,12.62) v1(4.38,53.19) v1(4.38,49.19) v1(4.38,48.19) v1(6.1,33.07) v1(6.86,11.23) v1(7.64,33.07) v1(7.62,26.85) v1(7.75,49.07) v1(7.75,48.31) v1(8,55.68) v1(8,41.71) v1(8.25,10.59) v1(9.14,30.78) v1(9.14,27.99) v1(9.18,33.07) v1(9.4,66.73) v1(9.81,77.01) v1(9.95,55.68) v1(10.03,9.45) v1(10.16,41.71) v1(10.41,65.33) v1(10.54,66.73) v1(10.67,33.07) v1(11.12,30.78) v1(11.12,28.63) v1(11.3,54.28) v1(11.56,67.23) v1(11.81,77.01) v1(12.27,33.07) v1(12.69,9.45) v1(12.7,7.29) v1(12.7,5.26) v1(12.83,55.04) v1(13.08,44.37) v1(13.08,42.56) v1(13.84,30.78) v1(13.84,28.63) v1(13.97,33.07) v1(13.97,2.59) v1(14.32,77.01) v1(14.61,42.72) v1(14.61,41.27) v1(15.11,7.29) v1(15.11,5.19) v1(15.63,33.07) v1(15.62,9.45) v1(16.13,30.78) v1(16.13,28.63) v1(16.38,77.01) v1(17.4,21.9) v1(17.4,13.13) v1(17.42,9.45) v1(17.65,33.07) v1(17.91,17.83) v1(18.11,13.13) v1(18.23,21.9) v1(18.54,33.96) v1(18.8,77.01) v1(18.8,28.63) v1(19.05,37.64) v1(20.45,68.25) v1(20.45,64.57) v1(20.7,41.71) v1(20.7,38.82) v1(21.05,66.6) v1(21.21,27.61) v1(21.81,64.82) v1(21.95,66.6) v1(22.22,10.85) v1(22.61,78.41) v1(22.79,64.82) v1(22.87,66.6) v1(22.99,27.36) v1(22.99,25.82) v1(23.5,7.16) v1(23.75,66.6) v1(23.75,64.82) v1(23.94,79.81) v1(24.29,28.25) v1(25.02,7.16) v1(25.91,28.25) v1(26.42,7.16) v1(26.48,79.81) v1(26.46,77.52) v1(27.18,29.13) v1(28.83,30.66) v1(28.96,7.16) v1(29.43,79.81) v1(29.46,77.52) v1(30.21,7.16) v1(30.48,27.86) v1(30.86,31.67) v1(31.62,51.49) v1(31.62,49.45) v1(31.62,47.3) v1(31.62,45.64) v1(31.62,7.16) v1(31.68,27.86) v1(32.32,79.81) v1(32.3,77.52) v1(32.64,13) v1(33.02,7.16) v1(33.66,45.64) v1(33.91,65.2) v1(33.91,52.12) v1(34.04,79.81) v1(34.04,77.52) v1(34.04,58.22) v1(34.04,11.1) v1(34.04,9.66) v1(34.04,8.05) v1(34.16,24.18) v1(34.35,53.01) v1(34.42,27.86) v1(34.54,31.67) v1(34.88,65.2) v1(35.05,59.23) v1(35.25,24.18) v1(35.56,70.41) v1(35.56,69) v1(35.56,67.39) v1(35.69,79.81) v1(35.69,78.63) v1(35.69,53.01) v1(36.02,65.2) v1(36.02,63.84) v1(36.83,51.49) v1(36.83,49.63) v1(36.94,27.86) v1(37.72,31.67) v1(37.97,10.08) v1(38.86,47.93) v1(38.86,46.63) v1(39.12,60.13) v1(39.12,59.23) v1(39.12,49.71) v1(39.24,65.71) v1(39.24,64.66) v1(39.24,63.55) v1(39.24,21.26) v1(39.24,18.47) v1(39.24,15.54) v1(39.24,12.88) v1(39.37,69.52) v1(39.37,68) v1(39.75,27.86) v1(39.75,24.31) v1(40,13.51) v1(40.13,61.01) v1(40.31,21.26) v1(40.31,18.47) v1(40.34,15.54) v1(40.89,69.65) v1(40.89,68) v1(40.89,32.31) v1(41.91,18.72) v1(42.42,26.34) v1(42.47,69.65) v1(42.47,68) v1(42.54,49.71) v1(42.72,33.83) v1(42.84,63.55) v1(43.18,50.72) v1(43.18,47.17) v1(43.35,18.72) v1(43.43,60) v1(44.83,52.12) v1(45,60) v1(44.96,46.66) v1(44.97,18.72) v1(45.09,12.75) v1(45.34,33.83) v1(45.85,17.58) v1(45.85,15.99) v1(45.85,13.64) v1(46.07,45.39) v1(46.23,59.49) v1(46.86,58.22) v1(46.86,56.67) v1(46.86,42.85) v1(47.12,55.42) v1(47.12,32.18) v1(47.18,52.12) v1(47.88,27.74) v1(48.25,42.85) v1(48.64,45.39) v1(48.7,55.42) v1(48.77,1.32) v1(48.9,58.22) v1(48.9,56.69) v1(48.9,12.24) v1(49.02,8.81) v1(49.4,59.49) v1(49.42,52.12) v1(49.4,32.18) v1(49.83,27.74) v1(49.83,22.99) v1(49.91,92.38) v1(49.91,90.22) v1(49.91,87.46) v1(49.91,84.38) v1(49.91,81.58) v1(49.91,77.9) v1(50.16,46.66) v1(50.16,12.24) v1(50.21,8.81) v1(50.93,74.47) v1(50.93,62.28) v1(51.18,93.65) v1(51.18,49.71) v1(51.44,1.32) v1(51.45,12.24) v1(51.64,8.81) v1(51.69,32.18) v1(51.77,27.74) v1(51.94,10.59) v1(53.09,62.28) v1(53.19,63.71) v1(53.44,10.59) v1(53.47,74.47) v1(53.72,27.74) v1(53.72,22.99) v1(53.85,69.9) v1(53.89,94.16) v1(54.1,32.18) v1(54.32,1.32) v1(54.36,66.22) v1(54.36,65) v1(54.36,63.71) v1(54.48,61.9) v1(54.77,49.71) v1(54.86,37.39) v1(55.65,69.9) v1(55.71,60.89) v1(55.66,27.74) v1(55.75,51.49) v1(55.75,49.71) v1(55.75,48.02) v1(56.26,39.04) v1(56.26,37.39) v1(56.26,32.18) v1(56.39,94.16) v1(57.21,1.32) v1(57.28,52.25) v1(57.61,27.74) v1(57.61,22.99) v1(57.77,69.9) v1(57.91,60) v1(58.04,39.04) v1(58.42,47.42) v1(58.65,32.18) v1(58.67,57.07) v1(58.67,56.17) v1(58.67,55.25) v1(58.67,52.25) v1(58.67,44.37) v1(58.67,43.45) v1(58.67,42.59) v1(58.88,94.16) v1(58.93,81.71) v1(59.56,27.74) v1(59.69,74.47) v1(59.69,48.56) v1(59.84,81.71) v1(59.84,56.17) v1(59.84,55.25) v1(60.03,44.37) v1(60.03,43.45) v1(60.03,42.59) v1(60.09,1.32) v1(60.17,52.25) v1(60.2,11.86) v1(60.31,69.9) v1(60.26,39.04) v1(60.45,60) v1(60.71,78.03) v1(60.71,76.86) v1(60.71,75.49) v1(60.96,51.23) v1(60.96,49.83) v1(60.96,32.18) v1(61.24,55.25) v1(61.27,94.16) v1(61.34,44.37) v1(61.34,43.45) v1(61.34,42.59) v1(61.34,10.59) v1(61.5,27.74) v1(61.5,22.99) v1(61.72,38.02) v1(61.72,35.99) v1(61.72,34.04) v1(62.17,74.47) v1(62.36,58.6) v1(62.55,69.9) v1(62.61,55.3) v1(62.98,1.32) v1(63.45,27.74) v1(63.5,57.84) v1(63.5,54.15) v1(63.5,10.59) v1(63.63,85.65) v1(63.63,83.65) v1(63.63,64.44) v1(63.63,62.53) v1(63.63,60.71) v1(63.81,94.16) v1(64.26,52.88) v1(64.26,51.87) v1(64.95,69.9) v1(64.98,85.61) v1(64.98,83.65) v1(65.15,74.47) v1(65.41,44.88) v1(65.4,43.31) v1(65.4,39.42) v1(65.4,35.52) v1(65.4,31.63) v1(65.4,29.68) v1(65.4,27.74) v1(65.4,22.99) v1(65.66,10.59) v1(65.86,1.32) v1(66.29,94.16) v1(66.57,51.87) v1(66.8,43.61) v1(66.8,38.02) v1(67.31,80.82) v1(67.31,79.16) v1(67.9,51.87) v1(67.94,10.59) v1(68.2,58.85) v1(68.35,43.61) v1(68.45,81.58) v1(68.58,39.93) v1(68.71,94.16) v1(68.71,74.47) v1(68.75,1.32) v1(68.79,33.74) v1(68.79,29.85) v1(68.79,25.96) v1(69.32,91.82) v1(69.32,89.52) v1(69.66,58.85) v1(69.72,11.86) v1(69.98,18.97) v1(70.06,81.58) v1(70.14,52.38) v1(70.14,51.49) v1(70.14,50.69) v1(70.87,41.58) v1(71.51,81.58) v1(71.63,1.32) v1(71.75,59.71) v1(71.75,58.72) v1(72.01,52.38) v1(72.01,51.49) v1(72.01,50.69) v1(72.03,18.97) v1(72.14,37.6) v1(72.37,94.16) v1(72.37,91.82) v1(72.37,89.52) v1(72.39,11.86) v1(72.77,17.32) v1(73.03,60.25) v1(73.66,2.97) v1(74.49,94.16) v1(74.51,41.66) v1(74.68,74.98) v1(75.82,5) v1(76.03,37.6) v1(76.07,73.46) v1(76.58,59.11) v1(77.28,94.16) v1(77.47,54.28) v1(77.47,52.5) v1(77.47,50.98) v1(77.6,6.15) v1(77.98,57.71) v1(78.4,41.66) v1(78.74,52.5) v1(78.7,50.98) v1(78.76,54.28) v1(79.76,64.57) v1(79.76,62.85) v1(79.76,60.72) v1(79.92,37.6) v1(80.14,94.16) v1(80.39,57.71) v1(80.39,21.64) v1(80.61,6.15) v1(82.04,74.09) v1(82.03,21.64) v1(82.3,41.66) v1(82.83,57.71) v1(82.93,94.16) v1(83.49,6.15) v1(83.81,37.6) v1(83.87,21.64) v1(83.99,43.42) v1(84.75,45.68) v1(84.96,56.69) v1(85.34,74.09) v1(85.58,94.16) v1(86.23,39.38) v1(86.74,54.53) v1(88.39,94.16) v1(88.65,53.9) v1(88.65,45.68) v1(88.65,41.79) v1(88.77,74.09) v1(91.31,91.32) v1(91.31,89.46) v1(92.24,74.09) v1(92.71,53.9) v1(94.49,91.11) v1(94.49,89.46) v1(94.76,55.55) v1(95.38,88.14) v1(95.38,85.52) v1(95.38,82.86) v1(95.38,80.19) v1(95.38,77.46) v1(95.38,74.85) v1(96.67,55.55) v1(97.79,46.66) v1(98.43,55.55) v2(18.8,30.78) v2(20.95,33.71) v2(23.09,35.86) v2(26.1,35.86) v2(26.26,19.64) v2(26.26,17.89) v2(26.26,16.15) v2(27.92,19.64) v2(27.92,16.15) v2(29.08,35.86) v2(29.67,19.64) v2(29.67,17.89) v2(29.67,16.15) v2(30.61,37.39) v2(32.26,39.04) v2(34.15,39.04) v2(35.56,37.39) v2(37.21,35.86) v2(39.68,35.86) v2(42.69,35.86) v2(44.44,38.79) v2(47.04,38.79) v2(49.38,38.79) v2(51.56,38.79) v2(86.11,8.81) v2(87.38,17.96) v2(88.65,11.61) v2(89.41,19.86) v2(90.17,31.55) v2(90.17,28.5) v2(90.17,25.45) v2(90.17,22.4) v2(90.3,40.56) v2(90.3,37.52) v2(90.3,34.59) v2(91.06,14.28) v2(92.96,16.43) v2(95,46.66) v2(95,43.63) v2(95,40.59) v2(95,37.56) v2(95,34.53) v2(95,31.49) v2(95,28.46) v2(95,25.43) v2(95,22.39) v2(95,18.85)
#CH0: length 15.7
  Top Layer w0.254: U11.29 31.18,24.62 32.26,25.71 32.77,25.71
  Top Layer w0.381: 42.65,23.37 42.59,23.37 40.26,25.71 32.77,25.71
#CH1: length 20.9
  Top Layer w0.254: 31.24,29.59 30.42,29.59 28.17,27.34 U11.35
  Top Layer w0.381: 31.24,29.59 R67.2
#CH2: length 4.4
  Top Layer w0.254: U11.9 28.67,12.6 28.15,12.07 R63.2
#CH3: length 4.8
  Top Layer w0.254: R65.2 32.51,9.68 32.51,11.61 31.18,12.94 U11.14
#CS: length 10.7
  Top Layer w0.203: U11.47 17.61,19.14 16.64,20.12 R50.2
#DRDY_ADC: length 9.6
  Top Layer w0.254: U7.19 12.2,49.82 7.84,54.19 FPC1.13
CH0: length 21
  Top Layer w0.254: U11.30 30.68,24.88 32.26,26.47 32.77,26.47
  Top Layer w0.381: 32.77,26.47 40.51,26.47 42.08,24.9 C68.2
  Top Layer w0.508: 43.93,23.37 43.93,24.87 C68.2 45.48,24.9 L5.1
CH1: length 26.8
  Top Layer w0.254: U11.36 27.68,27.6 30.35,30.28 31.24,30.28
  Top Layer w0.381: 31.24,30.28 41.15,30.28 41.91,31.04 C63.2
  Top Layer w0.508: 43.96,30.56 43.98,30.54 L2.1 ; 43.96,30.56 R59.2 ; 43.96,30.56 43.96,31.01 C63.2
CH2: length 4.7
  Top Layer w0.254: R62.2 26.79,11.6 28.17,12.98 U11.8
CH3: length 4.5
  Top Layer w0.254: U11.13 30.68,12.56 31.2,12.03 R64.2
CLK_25M: length 4.1
  Top Layer w0.254: X1.3 42.11,16.95 C54.1
CLK_ADC: length 10.5
  Top Layer w0.254: U7.25 11.25,45.72 8.72,43.19 FPC1.2
CLK_MODE_SEL: length 6.3
  Top Layer w0.254: R42.1 R43.2 36.48,18.47 35.05,18.47 34.38,19.14 U11.24
DOWNCONVERSION_OF_INCIDENT: length 20.5
  Top Layer w0.254: R36.1 28.83,51.11 29.72,51.99 29.72,55.55 31.12,56.95 36.1,56.95 U5.6 37.74,56.92 38.23,56.44 38.23,51.13 C14.2
DOWNCONVERSION_OF_REFLECTED: length 15.7
  Top Layer w0.254: R34.1 29.41,45.32 30.7,44.03 37.18,44.03 37.85,43.36 37.85,38.41 37.84,38.41
INCIDENT_SIGNAL: length 6.1
  Top Layer w0.254: R11.1 61.5,56.28 60.45,57.33 60.45,58.39 R24.1
IO_UPDATE: length 11
  Top Layer w0.203: U11.46 18.25,19.64 16.38,21.51 R49.2
MISO_ADC: length 8.4
  Top Layer w0.254: FPC1.9 9.04,50.19 10.41,48.82 U7.21
MOSI_ADC: length 9
  Top Layer w0.254: U7.20 11.31,49.32 8.44,52.19 FPC1.11
NSS_ADC: length 8.9
  Top Layer w0.254: FPC1.4 8.82,45.19 11.45,47.82 U7.23
P0: length 14.7
  Top Layer w0.203: U11.40 25.67,22.76 25.15,23.29 23.37,23.29 19.56,27.1 R45.2
P1: length 13.4
  Top Layer w0.203: U11.41 25.17,22.45 24.84,22.78 22.61,22.78 19.69,25.71 R46.2
P2: length 12.1
  Top Layer w0.203: R47.2 19.94,24.31 21.97,22.28 24.51,22.28 24.67,22.11 U11.42
P3: length 11
  Top Layer w0.203: R48.2 20.19,22.91 21.96,21.14 U11.43
PDC: length 14.2
  Top Layer w0.203: U11.4 26.17,13.14 25.4,12.37 22.35,12.37 20.95,10.97 R57.2
REFERENCE_SIGNAL: length 27.2
  Top Layer w0.508: 62.61,41.2 62.6,41.21 R22.2 ; 62.61,41.2 v1(62.61,46.79) ; 62.61,41.2 63.25,40.56 C67.1 ; v1(62.61,49.96) 62.61,52.76 61.43,53.94 R21.2
  Bottom Layer w0.508: v1(62.61,49.96) v1(62.61,46.79)
REFLECTED_SIGNAL: length 6.7
  Top Layer w0.254: R23.1 60.45,45.76 60.45,47.42 61.37,48.33 R12.1
REST: length 13.1
  Top Layer w0.203: R56.2 21.34,12.24 22.1,13 25.4,13 25.67,13.28 U11.3
SCK_ADC: length 8.3
  Top Layer w0.254: U7.22 10.55,48.32 9.42,47.19 FPC1.6
SCLK: length 10.3
  Top Layer w0.203: U11.48 13.78,18.64 R51.2
SDIO_0: length 10.9
  Top Layer w0.203: R52.2 17.27,17.32 17.91,16.69 21.59,16.69 22.55,17.64 U11.50
SDIO_1: length 10.7
  Top Layer w0.203: R53.2 13.83,16.18 21.97,16.18 22.94,17.14 U11.51
SDIO_2: length 11
  Top Layer w0.203: U11.52 23.2,16.64 22.1,15.54 17.14,15.54 16.38,14.78 R54.2
SDIO_3: length 11.4
  Top Layer w0.203: R55.2 16.51,13.51 17.91,14.91 22.22,14.91 23.46,16.14 U11.53
SWEEP_SIGNAL: length 45.9
  Top Layer w0.508: R4.2 86.61,43.22 83.19,39.8 70.74,39.8 66.8,35.86 66.8,26.97 64.5,24.67 C72.1 ; R4.2 R2.2 R1.2 ; R4.2 R3.2
$1N1628: length 8.5
  Top Layer w0.254: R11.2 U2.6 70.14,56.28 71.41,55.01 74.5,55.01
$1N1718: length 3.4
  Top Layer w0.254: U1.3 76.57,48.3 ; R8.2 R7.1
  Top Layer w0.508: R7.1 76.57,48.3
$1N1724: length 6.9
  Top Layer w0.254: R9.2 76.58,47.03 U1.2 72.89,47.03 72.64,46.79 72.64,43.98 R10.1
$1N1731: length 8.7
  Top Layer w0.254: R10.2 71.12,44 71.12,47.93 70.75,48.3 U1.6 66.59,48.3 R12.2
$1N1740: length 24.6
  Top Layer w0.254: R2.1 87.61,50.51 87.61,52.02 86.89,52.73 81.26,52.73 80.16,51.64 80.16,48.46 79.5,47.8 78.64,47.8 R7.2
  Top Layer w0.762: RF1.5 95.87,51.36 92.07,51.36 90.59,49.87 R1.1 R2.1
$1N1761: length 35.1
  Top Layer w0.254: 84.44,49.87 v1(84.44,51.23) ; v1(84.46,53.77) 84.46,54.41 82.58,56.28 74.5,56.28 ; R4.1 87.25,50.51 87.25,51.87 86.74,52.38 81.41,52.38 80.52,51.49 80.52,48.31 79.63,47.42 78.61,47.42 78.24,47.05 R9.1
  Top Layer w0.762: R6.2 R5.2 R3.1 R4.1
  Bottom Layer w0.254: v1(84.44,51.23) 84.46,51.25 v1(84.46,53.77)
$2N800: length 5
  Top Layer w0.254: R17.1 50.29,56.94 50.3,56.95 ; 50.3,56.95 R18.2 ; 50.3,56.95 51.56,56.95 51.97,57.35 U3.4
$2N820: length 5.1
  Top Layer w0.254: R15.1 R16.2 51.24,44.3 52.07,45.14 U4.4
$2N1363: length 3.4
  Top Layer w0.254: R21.1 56.26,53.94 55.78,53.46
$2N1368: length 3.4
  Top Layer w0.254: 55.78,58.94 55.78,58.88 56.26,58.4 57.46,58.4 57.46,58.41 R24.2
$2N1373: length 3.4
  Top Layer w0.254: U4.8 56.34,41.21 R22.1
$2N1573: length 3.3
  Top Layer w0.254: 59.01,45.69 56.41,45.69 U4.1
$2N2385: length 4.8
  Top Layer w0.254: 39.78,52.6 39.75,52.63 39.75,55.42 39.98,55.65 U5.2
$2N2408: length 10.2
  Top Layer w0.254: C14.1 41.58,51.03 43.56,53.01 43.56,54.92 44.05,55.4 R26.2 45.46,56.89 R27.1
$2N2437: length 1.7
  Top Layer w0.254: R25.2 45.48,53.91 R26.1
$2N2441: length 3.7
  Top Layer w0.254: C13.2 43.99,56.98 R27.2 U5.3
$2N2451: length 3.5
  Top Layer w0.254: R25.1 R17.2 50.74,53.46 U3.5
$2N2851: length 4.4
  Top Layer w0.254: R32.1 39.36,41.95 40.13,42.72 41.39,42.72 U6.2
$2N2861: length 9.9
  Top Layer w0.254: C18.1 40.89,38.41 43.31,40.82 43.31,42.09 43.81,42.6 44.85,42.6 R30.2 44.99,43.99 R31.1
$2N2866: length 1.6
  Top Layer w0.203: R29.2 R30.1
$2N2868: length 3.4
  Top Layer w0.254: C17.2 43.49,44.07 R31.2 41.43,44.03
$2N2878: length 4.3
  Top Layer w0.254: U4.5 51.76,40.44 50.72,40.44 R15.2 R29.1
$3N592: length 7.4
  Top Layer w0.254: U7.2 21.95,47.82 22.73,47.04 22.73,45.64 23.11,45.26 26.32,45.26 R34.2
$3N598: length 8.1
  Top Layer w0.254: R33.2 22.99,43.99 22.1,44.88 22.1,46.91 21.69,47.32 U7.1
$3N604: length 6.5
  Top Layer w0.254: U7.3 22.11,48.32 22.86,49.07 22.86,49.58 23.11,49.83 26.31,49.83 26.38,49.77
$3N610: length 7.3
  Top Layer w0.254: U7.4 21.72,48.82 22.22,49.33 22.22,50.72 22.66,51.16 26.32,51.16 26.38,51.11
$3N943: length 3.3
  Top Layer w0.254: 17.78,52.42 17.78,53.64 18.16,54.03 18.16,55.48 C24.2
$3N947: length 3.8
  Top Layer w0.254: C25.2 15.19,54.97 16.78,53.38 16.78,52.42
$3N1175: length 3
  Top Layer w0.254: C26.2 17.28,42.82 U7.28
$3N3214: length 3.7
  Top Layer w0.381: 32.6,68.49 R39.2 30.38,69.95
$3N3391: length 8.6
  Top Layer w0.381: R40.2 11.55,62.55 12.57,61.52 13.77,61.52 U9.1 13.8,61.52 15.62,61.52 16.85,60.29 R37.1
$4N2598: length 5.8
  Top Layer w0.254: U11.22 33.34,18.14 35.93,15.55 C53.2
$4N2603: length 5.4
  Top Layer w0.254: U11.23 33.86,18.64 35.55,16.95 C54.2
$4N2750: length 1.4
  Top Layer w0.381: R41.1 38.04,24.01 C55.2
$4N2803: length 5.5
  Top Layer w0.254: R41.2 34.8,22.66 32.78,20.64 U11.27
$4N3007: length 5.9
  Top Layer w0.254: U11.17 32.79,15.64 35.74,12.7 R44.2
$4N3721: length 6.6
  Top Layer w0.203: FPC2.1 8.41,12.85 10.29,10.97 R57.1
$4N3724: length 6.5
  Top Layer w0.203: R56.1 10.03,12.24 8.42,13.85 FPC2.2
$4N3727: length 6.4
  Top Layer w0.203: FPC2.3 8.69,14.85 10.03,13.51 R55.1
$4N3730: length 6.3
  Top Layer w0.203: R54.1 9.91,14.78 8.83,15.85 FPC2.4
$4N3733: length 6.2
  Top Layer w0.203: R53.1 9.65,16.05 8.85,16.85 FPC2.5
$4N3736: length 6.1
  Top Layer w0.203: FPC2.6 8.99,17.85 9.53,17.32 R52.1
$4N3739: length 5.9
  Top Layer w0.203: R51.1 9.53,18.72 9.39,18.85 FPC2.7
$4N3742: length 6
  Top Layer w0.203: R50.1 9.65,20.12 9.39,19.85 FPC2.8
$4N3745: length 6.1
  Top Layer w0.203: R49.1 9.53,21.51 8.87,20.85 FPC2.9
$4N3748: length 6.3
  Top Layer w0.203: R48.1 9.78,22.91 8.72,21.85 FPC2.10
$4N3751: length 6.5
  Top Layer w0.203: R47.1 9.78,24.31 8.33,22.85 FPC2.11
$4N3754: length 6.6
  Top Layer w0.203: R46.1 10.16,25.71 8.31,23.85 FPC2.12
$4N3757: length 6.8
  Top Layer w0.203: FPC2.13 8.17,24.85 10.41,27.1 R45.1
$4N4799: length 3.5
  Top Layer w0.508: L3.1 47.22,30.52 L2.2
$4N4809: length 3.4
  Top Layer w0.508: L3.2 53.73,30.52 C65.2 L4.1
$4N4823: length 4.4
  Top Layer w0.508: L4.2 56.87,30.55 C67.2
$4N5248: length 3.4
  Top Layer w0.508: L6.1 L5.2
$4N5252: length 3.4
  Top Layer w0.508: L7.1 L6.2
$4N5256: length 4.2
  Top Layer w0.508: C72.2 60.92,24.7 L7.2
$5N430: length 2.1
  Top Layer w0.508: U16.1 61.63,86.47 C76.1
$5N915: length 4.1
  Top Layer w0.508: R69.2 R68.1 62.82,81.47 U16.4
$5N1404: length 2.6
  Top Layer w0.508: C80.1 81.1,86.78 83.64,86.78
$5N1429: length 3.3
  Top Layer w0.508: R71.2 R70.1 83.94,82.67 83.64,82.97

## Copper pours and planes (outline as drawn; the poured copper is in the pictures)
+5V on Top Layer: 52.32,85.27 52.96,85.9 56.9,85.9 57.4,85.39 57.4,83.36 56.64,82.6 56.64,76.25 56.13,75.74 52.83,75.74 52.32,76.25
+5V_D on Top Layer: 45.85,1.57 45.85,5.13 45.97,5.26 52.58,5.26 52.83,5 52.83,3.1 52.58,2.84 46.37,2.84 46.33,2.8 46.33,2.05
+5V_D on Top Layer: 66.55,11.48 66.55,14.91 66.93,15.29 72.77,15.29 73.03,15.04 73.03,13.08 72.82,12.88 67.44,12.88 67.44,12.37
+6V on Top Layer: 88.36,85.2 93.78,85.2 93.98,85.39 93.98,88.19 93.85,88.32 91.44,88.32 91.31,88.19 91.31,86.44 90.91,86.03 88.52,86.03 88.36,85.87
+6V on Top Layer: 66.68,84.85 71.72,84.85 72.39,85.52 72.39,87.17 71.75,87.81 69.09,87.81 68.71,87.43 68.71,86.16 68.07,85.52 66.68,85.52
+A1.8V on Top Layer: 30.1,25.71 30.1,23.16 29.84,22.91 29.34,22.91 29.08,23.16 29.08,25.71
+A1.8V on Top Layer: 32.73,17.64 32.73,16.64 32.77,16.61 32.77,16.31 35.43,13.64 36.96,13.64 37.08,13.77 37.08,14.66 36.96,14.78 35.94,14.78 33.08,17.64
+A1.8V on Top Layer: 19.56,6.78 22.12,6.78 22.35,6.55 22.35,4.74 22.11,4.5 19.56,4.5 19.56,6.78
+A1.8V on Top Layer: 26.67,12.88 27.3,12.88 27.31,12.88 26.16,11.74 26.16,10.97 25.91,10.72 25.91,9.45 25.78,9.32 23.5,9.32 23.37,9.45 23.37,11.23 24.13,11.99 25.53,11.99 25.65,11.86
+A1.8V on Top Layer: 27.18,22.93 26.18,22.93 25.4,23.72 24.28,23.72 24.13,23.87 24.13,25.71 24.26,25.83 26.92,25.83 27.05,25.71 27.05,23.67 27.18,23.55
+A1.8V on Top Layer: 55.75,11.61 55.75,16.18 55.25,16.69 53.09,16.69 51.56,18.21 48.26,18.21 48.13,18.09 48.13,15.8 48.26,15.67 51.82,15.67 52.32,15.16 54.1,15.16 54.61,14.66 54.61,11.48 55.63,11.48
+D3.3V on Top Layer: 44.58,1.57 44.58,5.64 44.2,6.02 41.93,6.02 40.77,7.18 40.77,7.67 40.13,8.31 37.47,8.31 37.34,8.18 37.34,5.89 37.34,5.89 37.47,5.77 40.39,5.77 41.4,4.75 43.05,4.75 43.43,4.37 43.43,1.57
-2.5V on Top Layer: 14.73,56.57 15.83,56.57 16.43,55.96 16.43,55.55 17.24,55.55 17.24,56.31 17.53,56.6 19.27,56.6 19.56,56.31 19.56,55.3 19.76,55.1 21.09,55.1 22.73,56.74 22.73,60.76 21.39,60.76 21.39,58.15 21.08,57.84 14.86,57.84 14.73,57.71
-5V on Top Layer: 82.55,89.97 82.93,90.35 86.36,90.35 86.61,90.09 86.61,87.68 87.63,86.67 87.63,85.01 88.01,84.63 93.6,84.63 93.98,84.25 93.98,76.12 93.6,75.74 78.99,75.74 78.61,76.12 78.61,82.6 78.99,82.98 80.77,82.98 81.15,82.6 81.15,80.19 81.79,79.55 85.85,79.55 86.49,80.19 86.49,82.28 86.14,82.63 85.19,82.63 84.96,82.86 84.96,87.17 84.46,87.68 82.93,87.68 82.55,88.06
GND on Top Layer: 78.36,86.16 78.23,86.28 74.29,86.28 74.17,86.16 74.17,76.12 74.55,75.74 77.47,75.74 77.85,76.12 77.85,82.73 78.36,83.24
GND on Top Layer: 8.89,69.01 12.06,69.01 12.19,68.89 12.19,64.95 11.94,64.69 9.27,64.69 8.89,65.08
GND on Top Layer: 57.02,44.75 56.77,44.5 56.77,42.47 57.02,42.22 61.72,42.22 61.85,42.34 61.85,44.63 61.72,44.75
GND on Top Layer: 60.71,89.97 61.05,90.31 64.17,90.31 64.9,89.59 64.9,87.3 65.66,86.54 65.66,84.51 65.91,84.25 71.63,84.25 72.39,83.49 72.39,76.25 71.88,75.74 57.78,75.74 57.28,76.25 57.28,82.49 57.66,82.87 60.18,82.87 60.45,82.6 60.45,81.58 60.07,81.2 60.07,79.17 60.71,78.54 61.98,78.54 62.61,79.17 65.15,79.17 65.41,79.43 65.41,81.58 65.01,81.98 63.36,81.98 62.99,82.35 62.99,87.27 62.66,87.6 61.29,87.6 60.71,88.19
GND on Top Layer: 31.62,54.53 31.24,54.15 31.24,45.39 31.62,45.01 34.04,45.01 35.05,46.03 40.13,46.03 40.39,46.28 40.39,48.31 40.89,48.82 41.91,48.82 42.42,48.31 42.42,46.79 42.8,46.41 44.2,46.41 44.45,46.15 44.45,45.01 44.58,44.88 45.72,44.88 46.1,44.5 46.1,42.47 46.35,42.22 48.77,42.22 49.02,42.47 49.02,45.14 49.28,45.39 50.93,45.39 51.31,45.77 51.31,48.44 51.69,48.82 53.97,48.82 54.23,48.56 54.23,45.64 54.48,45.39 54.7,45.39 54.96,45.64 54.99,45.64 54.99,47.04 55.25,47.3 56.64,47.3 57.28,46.66 58.8,46.66 61.59,49.45 61.59,52.25 60.96,52.88 56.9,52.88 56.13,52.12 55.25,52.12 54.86,52.5 54.86,54.03 54.61,54.28 54.35,54.28 54.35,54.28 54.1,54.03 54.11,54.02 54.11,50.86 53.85,50.6 51.69,50.6 51.31,50.98 51.31,52.63 51.05,52.88 44.45,52.88 41.66,50.09 37.85,50.09 37.47,50.47 37.47,53.14 37.21,53.39 35.05,53.39 34.67,53.77 34.67,54.28 34.42,54.53
GND on Top Layer: 21.97,11.23 22.86,11.23 23.11,10.97 23.11,8.94 23.24,8.81 25.78,8.81 25.91,8.69 25.91,7.67 26.03,7.54 29.21,7.54 29.34,7.67 29.34,8.72 30.19,8.72 30.19,7.71 30.35,7.54 33.15,7.54 33.27,7.67 33.27,11.61 32.13,12.75 32.13,13.26 32.38,13.51 32.9,13.51 32.9,13.51 35.94,10.47 37.34,10.47 37.47,10.59 37.47,16.05 37.59,16.18 40.51,16.18 41.11,15.59 41.11,13.73 39.24,11.86 39.24,9.83 38.99,9.58 36.96,9.58 35.94,8.56 35.94,7.54 32.51,4.12 23.24,4.12 22.86,4.5 22.86,6.78 21.72,7.93 21.72,10.97
GND on Top Layer: 9.27,59.61 6.86,62.03 6.86,71.42 9.14,73.71 33.4,73.71 34.16,72.95 34.16,67.11 34.8,66.47 38.23,66.47 39.24,67.49 43.31,67.49 43.94,68.12 43.94,71.93 42.93,72.95 36.7,72.95 36.32,73.33 36.32,75.74 36.83,76.25 43.18,76.25 43.94,77.01 43.94,80.7 42.8,81.84 23.5,81.84 19.18,77.52 9.4,77.52 2.72,70.84 2.72,59.5 9.15,59.5
GND on Top Layer: 0.51,90.98 0.76,91.24 5.61,91.24 7.37,93 7.37,96.95 9.53,99.11 35.81,99.11 36.7,98.22 36.7,93.02 37.85,91.87 42.29,91.87 45.21,94.79 88.77,94.79 91.82,91.75 97.28,91.75 98.55,90.47 98.55,71.17 96.77,69.39 81.53,69.39 80.77,70.16 80.77,74.73 81.15,75.11 93.85,75.11 94.62,75.87 94.62,88.32 94.11,88.82 91.06,88.82 90.68,89.2 90.68,92.13 89.53,93.27 73.66,93.27 72.9,92.51 72.9,88.82 72.52,88.44 68.96,88.44 68.58,88.82 68.58,92.63 67.82,93.4 52.45,93.4 51.05,92 51.05,76 51.82,75.23 56.9,75.23 57.28,75.62 57.28,76.2 77.39,76.2 77.98,75.62 77.98,72.06 75.31,69.39 51.82,69.39 45.09,76.12 45.09,82.09 43.69,83.49 22.99,83.49 19.81,80.31 9.78,80.31 8.51,81.58 1.78,81.58 0.51,82.86
GND on Top Layer: 19.81,62.66 23.75,62.66 24.13,63.04 24.13,68.89 24,69.01 20.07,69.01 19.81,68.76
GND on Top Layer: 32.13,63.04 36.19,63.04 36.58,63.42 36.58,65.33 36.07,65.84 31.88,65.84 31.88,63.3
GND on Top Layer: 56.64,57.33 56.81,57.5 59.52,57.5 61.34,55.68 64.01,55.68 64.52,55.17 64.52,53.64 64.9,53.26 67.56,53.26 68.07,52.76 73.15,52.76 73.53,52.38 73.53,50.6 73.28,50.34 67.82,50.34 66.8,49.33 64.26,49.33 63.37,50.22 63.37,53.14 61.59,54.92 56.9,54.92 56.64,55.17
GND on Top Layer: 34.16,57.58 35.43,58.85 40.39,58.85 40.64,59.11 40.64,61.14 41.02,61.52 42.29,61.52 42.67,61.14 42.67,59.61 43.05,59.23 44.7,59.23 44.96,58.98 44.96,57.96 45.09,57.84 46.1,57.84 46.48,57.45 46.48,55.3 46.86,54.92 48.9,54.92 49.28,55.3 49.28,57.71 49.53,57.96 50.8,57.96 50.93,58.09 50.93,61.27 51.44,61.77 53.72,61.77 54.1,61.39 54.1,58.34 54.36,58.09 54.74,58.09 54.86,58.22 54.86,59.74 55.25,60.12 56.39,60.12 57.15,59.36 61.21,59.36 61.72,58.85 61.72,57.71 62.23,57.2 66.29,57.2 67.31,58.22 73.15,58.22 73.41,58.47 73.41,60.5 73.79,60.88 75.31,60.88 75.69,60.5 75.69,58.34 76.96,57.07 83.19,57.07 86.49,53.77 87.88,53.77 88.52,53.14 98.81,53.14 99.19,53.52 99.19,64.82 98.81,65.2 74.72,65.2 73.76,64.24 69.03,64.24 68.07,65.2 56.26,65.2 54.61,66.85 39.88,66.85 38.23,65.2 37.59,65.2 37.08,64.69 37.08,61.9 33.27,58.09 31.06,58.09 30.99,58.02 30.99,57.71 31.12,57.58
GND on Top Layer: 77.71,49.3 78.87,49.3 79.12,49.55 79.12,51.99 81.03,53.9 81.03,55.42 76.96,55.42 76.33,54.79 76.33,51.61 77.72,50.22 77.72,49.31
GND on Top Layer: 19.56,22.4 17.27,22.4 17.02,22.15 17.02,22.15 17.02,21.51 18.29,20.24 19.56,20.24
GND on Top Layer: 28.83,26.47 29.08,26.21 31.12,26.21 32,27.1 40.77,27.1 42.04,25.83 64.26,25.83 65.91,27.48 65.91,36.25 70.49,40.82 82.8,40.82 85.34,43.36 85.34,46.91 84.2,48.06 84.2,48.69 84.07,48.82 81.41,48.82 81.28,48.69 81.28,48.06 78.87,45.64 76.58,45.64 73.91,42.98 69.85,42.98 67.44,45.39 64.13,45.39 63.63,44.88 63.63,41.45 64.26,40.82 64.26,31.93 64.52,31.67 64.52,29.51 64.39,29.39 47.5,29.39 47.12,29.01 47.12,27.36 46.74,26.97 45.72,26.97 45.21,27.48 45.21,27.48 42.04,27.48 41.91,27.61 41.91,28.83 41.74,29.01 30.61,29.01 28.83,27.23
GND on Top Layer: 38.23,78.41 36.19,78.41 34.93,77.14 22.73,77.14 21.84,78.03 21.84,78.66 23.5,80.31 38,80.31 38.31,80.01 38.31,78.49
GND on Top Layer: 13.59,53.39 13.72,53.52 13.72,57.96 14.22,58.47 14.22,59.23 13.72,59.74 1.14,59.74 0.89,59.49 0.89,32.82 1.14,32.56 18.67,32.56 19.18,33.07 19.18,36.5 21.34,38.66 21.34,43.1 20.32,44.12 20.19,44.12 20.19,42.72 20.07,42.6 20.07,38.91 19.56,38.41 18.54,38.41 18.29,38.15 18.29,35.61 18.03,35.36 15.11,35.36 14.86,35.1 14.86,34.09 14.73,33.96 11.05,33.96 10.92,34.09 10.92,35.86 10.8,35.99 10.03,35.99 9.91,35.86 9.91,35.48 9.78,35.36 6.35,35.36 5.97,35.74 5.97,39.67 7.37,41.07 13.21,41.07 14.35,39.93 15.75,39.93 16.13,40.31 16.13,43.23 16.64,43.74 16.64,44.14 16.62,44.14 16.38,44.37 15.62,44.37 14.86,45.14 11.68,45.14 9.02,42.47 5.21,42.47 4.83,42.85 4.83,54.53 5.21,54.92 9.27,54.92 10.8,53.39
GND on Top Layer: 4.57,49.45 8.89,49.45 9.4,48.95 9.4,48.44 8.89,47.93 4.56,47.93 4.56,49.45
GND on Top Layer: 32.26,22.02 33.4,22.02 34.93,23.55 36.96,23.55 37.08,23.67 37.08,24.56 37.29,24.77 38.66,24.77 38.86,24.56 38.86,21.9 38.74,21.77 37.59,21.77 37.47,21.64 37.47,20.88 37.59,20.75 38.74,20.75 38.86,20.62 38.86,19.1 38.74,18.97 37.59,18.97 37.47,18.85 37.47,18.09 37.59,17.96 38.74,17.96 38.86,17.83 41.02,17.83 41.28,18.09 44.7,18.09 45.09,17.7 45.09,13.64 44.7,13.26 43.43,13.26 43.2,13.02 43.2,12.01 43.35,11.86 47.37,11.86 47.88,11.35 47.88,6.02 48.01,5.89 52.58,5.89 53.09,5.38 70.36,5.38 75.56,10.59 75.56,12.37 69.47,12.37 68.07,10.97 63.25,10.97 62.99,11.23 62.99,14.15 62.36,14.78 59.44,14.78 59.18,14.53 59.18,11.35 58.8,10.97 53.97,10.97 53.59,11.35 53.59,14.15 52.96,14.78 48.13,14.78 47.62,15.29 47.62,18.34 51.82,22.53 67.06,22.53 68.71,20.88 68.71,15.8 68.83,15.67 76.33,15.67 79.88,19.23 84.33,19.23 87.12,16.43 87.12,11.86 83.82,8.56 77.22,8.56 71.5,2.84 53.72,2.84 52.96,2.08 48.01,2.08 47.62,1.7 47.62,0.94 48.01,0.56 91.57,0.56 91.57,7.93 99.19,7.93 99.19,49.07 98.81,49.45 91.57,49.45 90.55,48.44 90.55,47.42 90.3,47.17 88.26,47.17 87.88,46.79 87.88,42.98 83.82,38.91 71.37,38.91 67.82,35.36 67.82,25.96 65.41,23.55 48.01,23.55 47.12,22.66 47.12,20.75 46.74,20.37 45.72,20.37 45.09,21.01 42.04,21.01 41.53,21.51 41.53,23.55 39.88,25.2 33.15,25.2 32.26,24.31
GND on Top Layer: 19.56,14.4 18.11,14.4 17.02,13.31 17.02,12.88 17.27,12.62 19.43,12.62 19.56,12.75
GND on Top Layer: 26.92,26.21 27.05,26.34 27.05,27.86 30.23,31.04 40.77,31.04 41.78,32.06 44.96,32.06 45.47,31.55 61.5,31.55 62.25,32.3 62.25,39.14 61.59,39.8 61.59,39.93 57.4,39.93 56.9,39.42 54.48,39.42 54.36,39.29 54.36,37.23 54.03,36.9 52.71,36.9 52.32,37.28 52.32,39.17 52.07,39.42 43.43,39.42 41.28,37.26 37.21,37.26 34.54,39.93 34.54,41.07 34.29,41.33 32.77,41.33 28.57,37.14 20.83,37.14 20.07,36.37 20.07,32.69 19.18,31.8 0.76,31.8 0.76,7.93 8.13,7.93 8.13,1.19 42.29,1.19 42.29,3.99 42.16,4.12 40.77,4.12 39.75,5.13 35.31,5.13 33.27,3.1 16.76,3.1 15.49,4.37 15.49,7.29 15.75,7.54 17.78,7.54 17.91,7.67 17.91,10.08 17.65,10.34 14.48,10.34 14.35,10.21 11.68,10.21 11.56,10.34 9.65,10.34 8,11.99 5.33,11.99 4.95,12.37 4.95,25.2 5.33,25.58 7.87,25.58 10.16,27.86 19.81,27.86 22.99,24.69 23.5,24.69 23.75,24.94 23.75,25.96 24,26.21
GND on Top Layer: 19.56,18.21 17.46,18.21 17.46,17.77 18.16,17.07 19.56,17.07
GND on Bottom Layer: 0.76,31.8 19.18,31.8 20.07,32.69 20.07,36.37 20.83,37.14 28.57,37.14 31.24,39.8 31.24,57.65 31.68,58.09 33.27,58.09 37.08,61.9 37.08,64.69 37.59,65.2 38.23,65.2 39.89,66.85 66.28,66.85 68.89,64.24 73.76,64.24 74.72,65.2 98.68,65.2 99.19,64.69 99.19,7.93 91.57,7.93 91.57,0.56 8.13,0.56 8.13,7.93 0.76,7.93
GND on Bottom Layer: 0.89,32.82 1.14,32.56 18.67,32.56 19.18,33.07 19.18,36.5 21.34,38.66 21.34,43.1 19.56,44.88 19.56,46.41 16.28,49.69 16.28,53.12 13.84,55.55 13.84,56.82 14.22,57.2 14.22,59.27 13.75,59.74 1.14,59.74 0.89,59.49
GND on Bottom Layer: 36.7,98.24 36.7,93.02 37.85,91.87 42.29,91.87 45.21,94.79 88.77,94.79 91.69,91.87 97.16,91.87 98.43,90.6 98.43,71.04 96.77,69.39 74.55,69.39 70.74,73.2 47.24,73.2 45.85,74.6 45.85,81.97 44.2,83.62 22.86,83.62 19.56,80.31 1.02,80.31 0.51,80.82 0.51,90.98 0.76,91.24 5.59,91.24 7.37,93.02 7.37,96.95 9.53,99.11 35.83,99.11
GND on Bottom Layer: 66.29,64.82 66.29,69.77 65.66,70.41 53.34,70.41 52.96,70.03 52.96,66.73 54.86,64.82
